# Altium project disp7segTester.PrjPcb
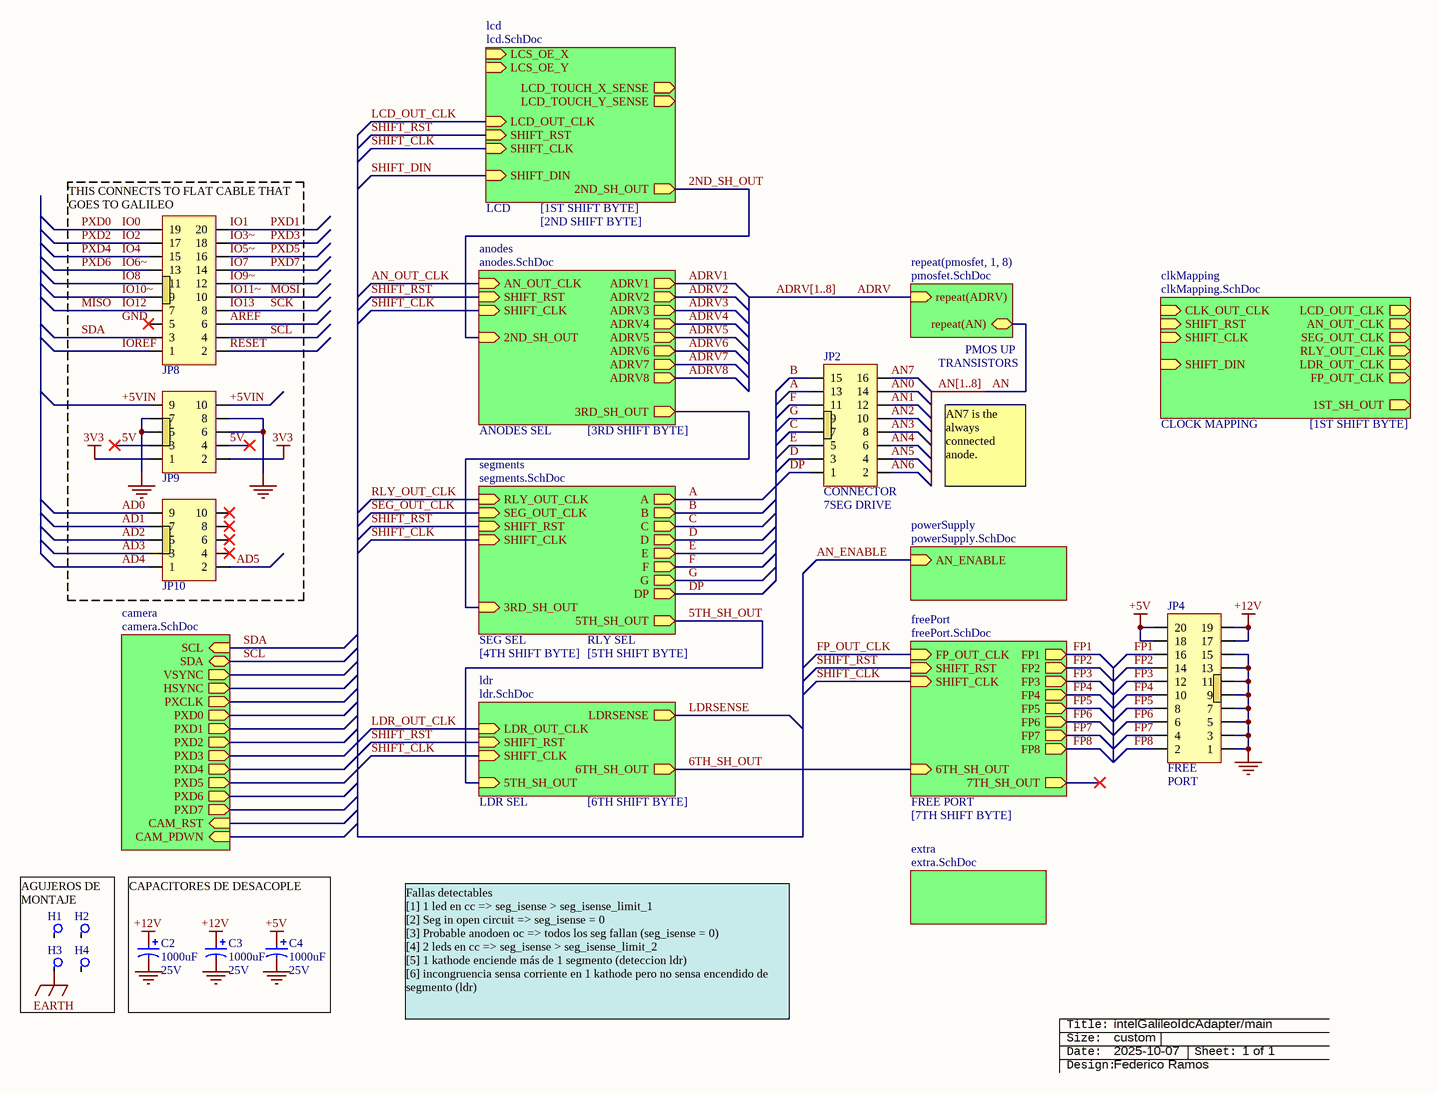
[diagram p0: disp7segTester.SchDoc]
14 sheets, 236 parts. Net scope: hierarchical (ports join the sheet entries above them; power ports are global).
Board file: disp7segTester.PcbDoc
Sheets:
  disp7segTester.SchDoc
    ldr = ldr.SchDoc
    segments = segments.SchDoc
      relayNetwork = relayNetwork.SchDoc
    anodes = anodes.SchDoc
    pmosfet1 = pmosfet.SchDoc
    pmosfet2 = pmosfet.SchDoc
    pmosfet3 = pmosfet.SchDoc
    pmosfet4 = pmosfet.SchDoc
    pmosfet5 = pmosfet.SchDoc
    pmosfet6 = pmosfet.SchDoc
    pmosfet7 = pmosfet.SchDoc
    pmosfet8 = pmosfet.SchDoc
    freePort = freePort.SchDoc
    powerSupply = powerSupply.SchDoc
    extra = extra.SchDoc
    camera = camera.SchDoc
      levelTranslate1 = levelTranslate.SchDoc
      levelTranslate2 = levelTranslate.SchDoc
      levelTranslate3 = levelTranslate.SchDoc
      levelTranslate4 = levelTranslate.SchDoc
      levelTranslate5 = levelTranslate.SchDoc
    lcd = lcd.SchDoc
    clkMapping = clkMapping.SchDoc
  signalTable.SchDoc

## Sheet disp7segTester.SchDoc: DE:TMP:11:UC:EXPANDIDO
size 386 x 254 mm; Date: 21-07-2022; SheetNumber: 1; SheetTotal: 1; WebFGR: www.abebashop.com; VersionFGR: 20220721; PageSetup: Record=PageOptions|CenterHorizontal=True|CenterVertical=True|PrintScale=0.74|XCorrection=1.00|YCorrection=1.00|PrintKind=0|BorderSize=5000000|LeftOffset=0|BottomOffset=0|Orientation=2|PaperLength=1000|PaperWidth=1000|Scale=100|PaperSource=7|PrintQuality=-4|MediaType=1|DitherType=10|PaperKind=Letter|PrintScaleMode=1

### Parts
(Parts that share a designator on the sheet are numbered #1, #2 ... from top to bottom, then left to right.)
C2  value 1000uF  Voltaje: 25V  [C_EL_6-3X11]  (hidden comment: Cap Pol)
C3  value 1000uF  Voltaje: 25V  [C_EL_6-3X11]  (hidden comment: Cap Pol)
C4  value 1000uF  Voltaje: 25V  [C_EL_6-3X11]  (hidden comment: Cap Pol)
H1  Agujero de montaje  [agujero]  (value not drawn)
H2  Agujero de montaje  [agujero]  (value not drawn)
H3  Agujero de montaje  [agujero]  (value not drawn)
H4  Agujero de montaje  [agujero]  (value not drawn)
JP2  con: CONNECTOR  [idc8x2_90]  (hidden comment: IDC 8x2 90deg)
JP4  IDC 10x2  [idc10x2]  (value not drawn)
JP8  IDC 10x2 90deg  [idc10x2_90]  (value not drawn)
JP9  IDC 5x2  [IDC5x2_90]  (value not drawn)
JP10  IDC 5x2  [IDC5x2_90]  (value not drawn)
ROT?#1  Rotulo_empty  (value not drawn)  (graphical)

### Sub-sheets
anodes = anodes.SchDoc: 3RD_SH_OUT (out), AN_OUT_CLK (in), SHIFT_RST (in), SHIFT_CLK (in), 2ND_SH_OUT (in), ADRV1 (out), ADRV2 (out), ADRV3 (out), ADRV4 (out), ADRV5 (out), ADRV6 (out), ADRV7 (out), ADRV8 (out)  | : [3RD SHIFT BYTE]; : ANODES SEL
camera = camera.SchDoc: SCL (in), SDA (bidir), VSYNC (out), HSYNC (out), PXD0 (out), PXD1 (out), PXD2 (out), PXD3 (out), PXD4 (out), PXD5 (out), PXD6 (out), PXD7 (out), CAM_RST (in), CAM_PDWN (in), PXCLK (out)
clkMapping = clkMapping.SchDoc: 1ST_SH_OUT (out), CLK_OUT_CLK (in), SHIFT_RST (in), SHIFT_CLK (in), SHIFT_DIN (in), LCD_OUT_CLK (out), AN_OUT_CLK (out), SEG_OUT_CLK (out), RLY_OUT_CLK (out), LDR_OUT_CLK (out), FP_OUT_CLK (out)  | : [1ST SHIFT BYTE]; : CLOCK MAPPING
extra = extra.SchDoc: no entries
freePort = freePort.SchDoc: 7TH_SH_OUT (out), FP_OUT_CLK (in), SHIFT_RST (in), SHIFT_CLK (in), 6TH_SH_OUT (in), FP1 (out), FP2 (out), FP3 (out), FP4 (out), FP5 (out), FP6 (out), FP7 (out), FP8 (out)  | : [7TH SHIFT BYTE]; : FREE PORT
lcd = lcd.SchDoc: LCD_OUT_CLK (in), SHIFT_RST (in), SHIFT_CLK (in), SHIFT_DIN (in), 2ND_SH_OUT (out), LCS_OE_Y (in), LCS_OE_X (in), LCD_TOUCH_X_SENSE (out), LCD_TOUCH_Y_SENSE (out)  | : LCD; : [1ST SHIFT BYTE]; : [2ND SHIFT BYTE]
ldr = ldr.SchDoc: LDRSENSE (out), LDR_OUT_CLK (in), SHIFT_RST (in), SHIFT_CLK (in), 5TH_SH_OUT (in), 6TH_SH_OUT (out)  | : [6TH SHIFT BYTE]; : LDR SEL
powerSupply = powerSupply.SchDoc: AN_ENABLE (in)
repeat(pmosfet, 1, 8) = pmosfet.SchDoc: repeat(AN), repeat(ADRV) (in)  | : TRANSISTORS; : PMOS UP
segments = segments.SchDoc: 5TH_SH_OUT (out), RLY_OUT_CLK (in), SEG_OUT_CLK (in), SHIFT_RST (in), SHIFT_CLK (in), 3RD_SH_OUT (in), A (out), B (out), C (out), D (out), E (out), F (out), G (out), DP (out)  | : [5TH SHIFT BYTE]; : SEG SEL; : RLY SEL; : [4TH SHIFT BYTE]

### Nets
3V3: JP9.1 JP9.2
+5V: C4.1 JP4.18 JP4.20
+12V: C2.1 C3.1 JP4.17 JP4.19
EARTH: H3.1
GND: C2.2 C3.2 C4.2 JP4.1 JP4.3 JP4.5 JP4.7 JP4.9 JP4.11 JP4.13 JP4.15 JP9.5 JP9.6 JP9.7 JP9.8
2ND_SH_OUT: sheet anodes/2ND_SH_OUT, sheet lcd/2ND_SH_OUT
3RD_SH_OUT: sheet segments/3RD_SH_OUT, sheet anodes/3RD_SH_OUT
5TH_SH_OUT: sheet ldr/5TH_SH_OUT, sheet segments/5TH_SH_OUT
5V: JP9.3 JP9.4
6TH_SH_OUT: sheet ldr/6TH_SH_OUT, sheet freePort/6TH_SH_OUT
+5VIN: JP9.9 JP9.10
A: JP2.13 ; sheet segments/A
AD0: JP10.9
AD1: JP10.7
AD2: JP10.5
AD3: JP10.3
AD4: JP10.1
AD5: JP10.2
AN0: JP2.14
AN1: JP2.12
AN2: JP2.10
AN3: JP2.8
AN4: JP2.6
AN5: JP2.4
AN6: JP2.2
AN7: JP2.16
AREF: JP8.6
B: JP2.15 ; sheet segments/B
C: JP2.7 ; sheet segments/C
D: JP2.3 ; sheet segments/D
DP: JP2.1 ; sheet segments/DP
E: JP2.5 ; sheet segments/E
F: JP2.11 ; sheet segments/F
FP1: JP4.16 ; sheet freePort/FP1
FP2: JP4.14 ; sheet freePort/FP2
FP3: JP4.12 ; sheet freePort/FP3
FP4: JP4.10 ; sheet freePort/FP4
FP5: JP4.8 ; sheet freePort/FP5
FP6: JP4.6 ; sheet freePort/FP6
FP7: JP4.4 ; sheet freePort/FP7
FP8: JP4.2 ; sheet freePort/FP8
G: JP2.9 ; sheet segments/G
IO0: JP8.19  [also labelled PXD0]
IO1: JP8.20  [also labelled PXD1]
IO2: JP8.17  [also labelled PXD2]
IO3~: JP8.18  [also labelled PXD3]
IO4: JP8.15  [also labelled PXD4]
IO5~: JP8.16  [also labelled PXD5]
IO6~: JP8.13  [also labelled PXD6]
IO7: JP8.14  [also labelled PXD7]
IO8: JP8.11
IO9~: JP8.12
IO10~: JP8.9
IO11~: JP8.10  [also labelled MOSI]
IO12: JP8.7  [also labelled MISO]
IO13: JP8.8  [also labelled SCK]
IOREF: JP8.1
RESET: JP8.2
SCL: JP8.4 ; sheet camera/SDA
SDA: JP8.3 ; sheet camera/SCL  [project net SCL]
SHIFT_CLK: sheet ldr/SHIFT_CLK, sheet segments/SHIFT_CLK, sheet anodes/SHIFT_CLK, sheet freePort/SHIFT_CLK, sheet lcd/SHIFT_CLK
SHIFT_RST: sheet ldr/SHIFT_RST, sheet segments/SHIFT_RST, sheet anodes/SHIFT_RST, sheet freePort/SHIFT_RST, sheet lcd/SHIFT_RST

Not connected (* = marked no-connect by the designer): H1 1; H2 1; H4 1; JP8 5*; JP10 4* 6* 8* 10*

### Buses and harness runs
bus ADRV[1..8]
bus AN[1..8]

### Notes on the sheet
- (near JP8) THIS CONNECTS TO FLAT CABLE THAT GOES TO GALILEO
- AN7 is the always connected anode.
- AGUJEROS DE MONTAJE
- CAPACITORES DE DESACOPLE
- Fallas detectables
  [1] 1 led en cc => seg_isense > seg_isense_limit_1
  [2] Seg in open circuit => seg_isense = 0
  [3] Probable anodoen oc => todos los seg fallan (seg_isense = 0)
  [4] 2 leds en cc => seg_isense > seg_isense_limit_2
  [5] 1 kathode enciende más de 1 segmento (deteccion ldr)
  [6] incongruencia sensa corriente en 1 kathode pero no sensa encendido de segmento (ldr)
- intelGalileoIdcAdapter/main
- custom
- 2025-10-07
- (near ROT?#1) 1 of 1
- Federico Ramos
- Labels drawn without touching a wire or pin: GND
- (in symbol IDC 5x2) AUX; OTRAS; SEÑALES
- (in symbol IDC 8x2 90deg) 7SEG DRIVE
- (in symbol IDC 10x2) FREE; PORT
- (in symbol Rotulo_empty) Title:; Size:; Date:; Sheet:; Design:

### Library data of the parts
C2-C4 = Cap Pol: Capacitor Electrolítico
JP2 = IDC 8x2 90deg: outout: OUTPUT; drv: DRIVE
ROT?#1 = Rotulo_empty: Rotulo [consolas]

## Sheet ldr.SchDoc: DE:TMP:11:UC:EXPANDIDO
size 203 x 139 mm; Date: 21-07-2022; SheetNumber: 1; SheetTotal: 1; WebFGR: www.abebashop.com; VersionFGR: 20220721; PageSetup: Record=PageOptions|CenterHorizontal=True|CenterVertical=True|PrintScale=0.94|XCorrection=1.00|YCorrection=1.00|PrintKind=0|BorderSize=5000000|LeftOffset=0|BottomOffset=0|Orientation=2|PaperLength=1000|PaperWidth=1000|Scale=100|PaperSource=7|PrintQuality=-4|MediaType=1|DitherType=10|PaperKind=Letter|PrintScaleMode=1
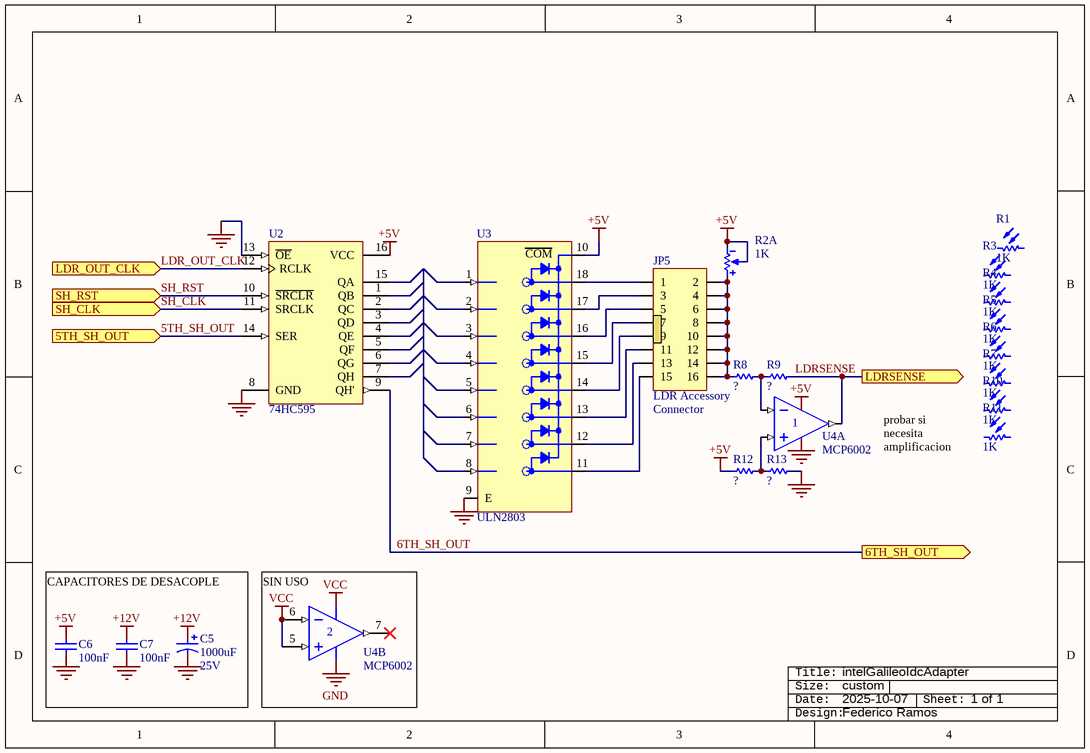
[diagram p1: ldr.SchDoc]

### Parts
(Parts that share a designator on the sheet are numbered #1, #2 ... from top to bottom, then left to right.)
C5  value 1000uF  Voltaje: 25V  [C_EL_6-3X11]  (hidden comment: Cap Pol)
C6  value 100nF  [c1206]  (hidden comment: Cap)
C7  value 100nF  [c1206]  (hidden comment: Cap)
JP5  IDC 8x2  [idc8x2]  (value not drawn)
R1  value 1K  [0805]  (hidden comment: LDR)
R2  value 1K  [conpol4x1]  (hidden comment: RVar)  (part A of 2)
R3  value 1K  [0805]  (hidden comment: LDR)
R4  value 1K  [0805]  (hidden comment: LDR)
R5  value 1K  [0805]  (hidden comment: LDR)
R6  value 1K  [0805]  (hidden comment: LDR)
R7  value 1K  [0805]  (hidden comment: LDR)
R8  Res  [R1206]  (value not drawn)
R9  Res  [R1206]  (value not drawn)
R10  value 1K  [0805]  (hidden comment: LDR)
R11  value 1K  [0805]  (hidden comment: LDR)
R12  Res  [R1206]  (value not drawn)
R13  Res  [R1206]  (value not drawn)
ROT?#2  Rotulo_empty  (value not drawn)  (graphical)
U2  74HC595  [DIP16]
U3  ULN2803  [DIP18Z]
U4  MCP6002  [dip8z]  (parts A,B of 2)

### Ports
5TH_SH_OUT (in), 6TH_SH_OUT (out), LDR_OUT_CLK (in), LDRSENSE (out), SH_CLK (in), SH_RST (in)

### Nets
+5V: C6.2 R2.2 R2.3 R12.2 U2.16(VCC) U3.10(~{COM}) U4.8(V+)
+12V: C5.1 C7.2
GND: C5.2 C6.1 C7.1 R13.1 U2.8(GND) U2.13(~{OE}) U3.9(E) U4.4(V-)
VCC: U4.5(IN+) U4.6(IN-) U4.8(V+)
5TH_SH_OUT: U2.14(SER) ; port 5TH_SH_OUT
6TH_SH_OUT: U2.9(QH') ; port 6TH_SH_OUT
LDR_OUT_CLK: U2.12(RCLK) ; port LDR_OUT_CLK
LDRSENSE: R9.1 U4.1(OUT) ; port LDRSENSE
SH_CLK: U2.11(SRCLK) ; port SH_CLK
SH_RST: U2.10(~{SRCLR}) ; port SH_RST
NetJP5_1: JP5.1 U3.18(~{C}1)
NetJP5_2: JP5.2 JP5.4 JP5.6 JP5.8 JP5.10 JP5.12 JP5.14 JP5.16 R2.1 R8.2
NetJP5_3: JP5.3 U3.17(~{C}2)
NetJP5_5: JP5.5 U3.16(~{C}3)
NetJP5_7: JP5.7 U3.15(~{C}4)
NetJP5_9: JP5.9 U3.14(~{C}5)
NetJP5_11: JP5.11 U3.13(~{C}6)
NetJP5_13: JP5.13 U3.12(~{C}7)
NetJP5_15: JP5.15 U3.11(~{C}8)
NetR8_1: R8.1 R9.2 U4.2(IN-)
NetR12_1: R12.1 R13.2 U4.3(IN+)

Not connected (* = marked no-connect by the designer): R1 1 2; R3 1 2; R4 1 2; R5 1 2; R6 1 2; R7 1 2; R10 1 2; R11 1 2; U2 1(QB) 2(QC) 3(QD) 4(QE) 5(QF) 6(QG) 7(QH) 15(QA); U3 1(B1) 2(B2) 3(B3) 4(B4) 5(B5) 6(B6) 7(B7) 8(B8); U4 7(OUT)*

### Notes on the sheet
- probar si necesita amplificacion
- CAPACITORES DE DESACOPLE
- (near U4) SIN USO
- intelGalileoIdcAdapter
- custom
- 2025-10-07
- (near ROT?#2) 1 of 1
- Federico Ramos
- (in symbol IDC 8x2) LDR Accessory; Connector
- (in symbol Rotulo_empty) Title:; Size:; Date:; Sheet:; Design:
- (in symbol ULN2803) COM

### Library data of the parts
C5 = Cap Pol: Capacitor Electrolítico
C6 C7 = Cap: Capacitor; Voltage: 50V
R1 R3-R7 R10 R11 = LDR: Resistor; Power: 0.25W
R2 = RVar: Resistencia Variable; Set Position: 0,5
R8 R9 R12 R13 = Res: Resistencia; Power: 0.25W
ROT?#2 = Rotulo_empty: Rotulo [consolas]
U2 = 74HC595: 8-Bit Shift Register with 3-State Output Registers
U3 = ULN2803: Darlington Transistor Array
U4 = MCP6002: 1 MHz Bandwidth Low Power Op Amp

## Sheet segments.SchDoc: DE:TMP:11:UC:EXPANDIDO
size 248 x 127 mm; Date: 21-07-2022; SheetNumber: 1; SheetTotal: 1; WebFGR: www.abebashop.com; VersionFGR: 20220721; PageSetup: Record=PageOptions|CenterHorizontal=True|CenterVertical=True|PrintScale=0.94|XCorrection=1.00|YCorrection=1.00|PrintKind=0|BorderSize=5000000|LeftOffset=0|BottomOffset=0|Orientation=2|PaperLength=1000|PaperWidth=1000|Scale=100|PaperSource=7|PrintQuality=-4|MediaType=1|DitherType=10|PaperKind=Letter|PrintScaleMode=1
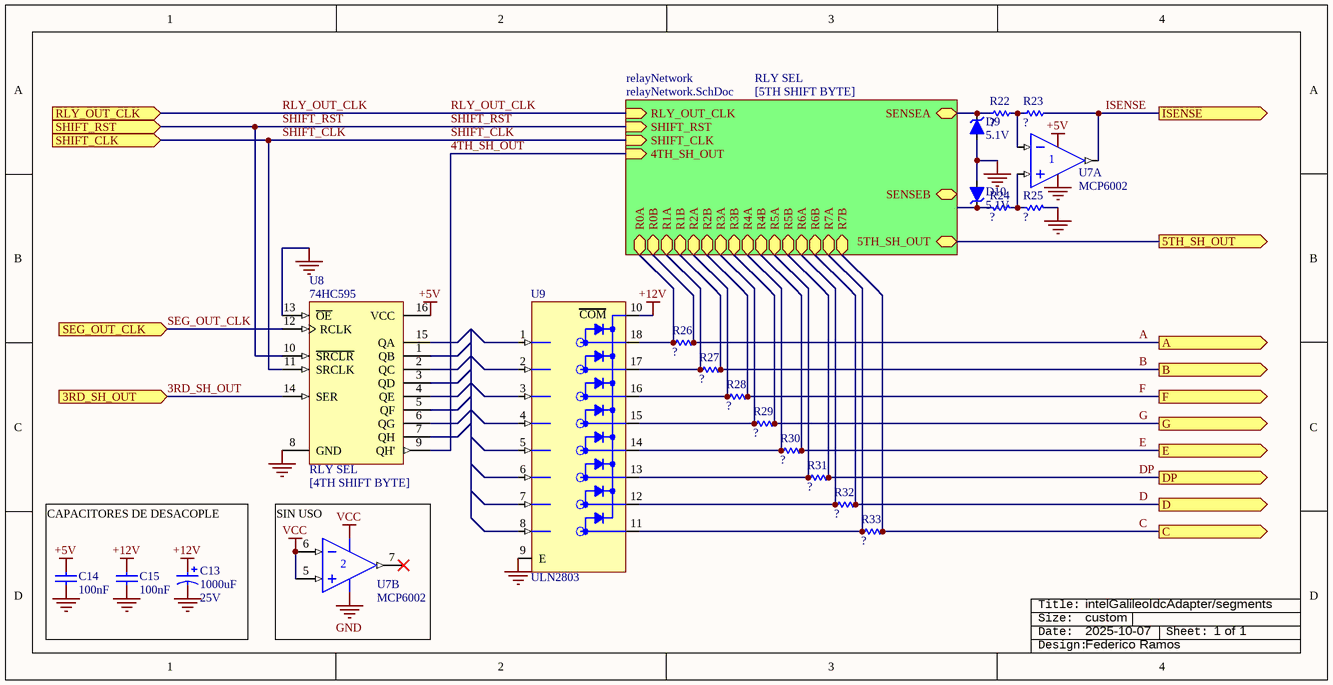
[diagram p2: segments.SchDoc]

### Parts
(Parts that share a designator on the sheet are numbered #1, #2 ... from top to bottom, then left to right.)
C13  value 1000uF  Voltaje: 25V  [C_EL_6-3X11]  (hidden comment: Cap Pol)
C14  value 100nF  [c1206]  (hidden comment: Cap)
C15  value 100nF  [c1206]  (hidden comment: Cap)
D9  VOLTAJE: 5.1V  [D_SOD27]  (hidden comment: Zener)
D10  VOLTAJE: 5.1V  [D_SOD27]  (hidden comment: Zener)
R22  Res  [R1206]  (value not drawn)
R23  Res  [R1206]  (value not drawn)
R24  Res  [R1206]  (value not drawn)
R25  Res  [R1206]  (value not drawn)
R26  Res  [R1206]  (value not drawn)
R27  Res  [R1206]  (value not drawn)
R28  Res  [R1206]  (value not drawn)
R29  Res  [R1206]  (value not drawn)
R30  Res  [R1206]  (value not drawn)
R31  Res  [R1206]  (value not drawn)
R32  Res  [R1206]  (value not drawn)
R33  Res  [R1206]  (value not drawn)
ROT?#3  Rotulo_empty  (value not drawn)  (graphical)
U7  MCP6002  [dip8z]  (parts A,B of 2)
U8  74HC595  [DIP16]
U9  ULN2803  [DIP18Z]

### Sub-sheets
relayNetwork = relayNetwork.SchDoc: R0A, R0B, R1A, R1B, R2A, R2B, R3A, R3B, R4A, R4B, R5A, R5B, R6A, R6B, R7A, R7B, SENSEB, SENSEA, RLY_OUT_CLK (in), SHIFT_RST (in), SHIFT_CLK (in), 4TH_SH_OUT (in), 5TH_SH_OUT  | : [5TH SHIFT BYTE]; : RLY SEL

### Ports
3RD_SH_OUT (in), 5TH_SH_OUT (out), A (out), B (out), C (out), D (out), DP (out), E (out), F (out), G (out), ISENSE (out), RLY_OUT_CLK (in), SEG_OUT_CLK (in), SHIFT_CLK (in), SHIFT_RST (in)

### Nets
+5V: C14.2 U7.8(V+) U8.16(VCC)
+12V: C13.1 C15.2 U9.10(~{COM})
GND: C13.2 C14.1 C15.1 D9.1(A) D10.1(A) R25.1 U7.4(V-) U8.8(GND) U8.13(~{OE}) U9.9(E)
VCC: U7.5(IN+) U7.6(IN-) U7.8(V+)
3RD_SH_OUT: U8.14(SER) ; port 3RD_SH_OUT
4TH_SH_OUT: U8.9(QH') ; sheet relayNetwork/4TH_SH_OUT
5TH_SH_OUT: port 5TH_SH_OUT, sheet relayNetwork/5TH_SH_OUT
A: R26.1 ; port A, sheet relayNetwork/R0B
B: R27.1 ; port B, sheet relayNetwork/R1B
C: R33.1 ; port C, sheet relayNetwork/R7B
D: R32.1 ; port D, sheet relayNetwork/R6B
DP: R31.1 ; port DP, sheet relayNetwork/R5B
E: R30.1 ; port E, sheet relayNetwork/R4B
F: R28.1 ; port F, sheet relayNetwork/R2B
G: R29.1 ; port G, sheet relayNetwork/R3B
ISENSE: R23.1 U7.1(OUT) ; port ISENSE
RLY_OUT_CLK: port RLY_OUT_CLK, sheet relayNetwork/RLY_OUT_CLK
SEG_OUT_CLK: U8.12(RCLK) ; port SEG_OUT_CLK
SHIFT_CLK: U8.11(SRCLK) ; port SHIFT_CLK, sheet relayNetwork/SHIFT_CLK
SHIFT_RST: U8.10(~{SRCLR}) ; port SHIFT_RST, sheet relayNetwork/SHIFT_RST
NetD9_2: D9.2(K) R22.2 ; sheet relayNetwork/SENSEA
NetD10_2: D10.2(K) R24.2
NetK1_8: R26.2 U9.18(~{C}1) ; sheet relayNetwork/R0A
NetK2_3: R27.2 U9.17(~{C}2) ; sheet relayNetwork/R1A
NetK3_8: R29.2 U9.15(~{C}4) ; sheet relayNetwork/R3A
NetK4_3: R30.2 U9.14(~{C}5) ; sheet relayNetwork/R4A
NetK5_8: R32.2 U9.12(~{C}7) ; sheet relayNetwork/R6A
NetR22_1: R22.1 R23.2 U7.2(IN-)
NetR24_1: R24.1 R25.2 U7.3(IN+)
NetR28_2: R28.2 U9.16(~{C}3) ; sheet relayNetwork/R2A
NetR31_2: R31.2 U9.13(~{C}6) ; sheet relayNetwork/R5A
NetR33_2: R33.2 U9.11(~{C}8) ; sheet relayNetwork/R7A

Not connected (* = marked no-connect by the designer): U7 7(OUT)*; U8 1(QB) 2(QC) 3(QD) 4(QE) 5(QF) 6(QG) 7(QH) 15(QA); U9 1(B1) 2(B2) 3(B3) 4(B4) 5(B5) 6(B6) 7(B7) 8(B8)

### Notes on the sheet
- CAPACITORES DE DESACOPLE
- (near U7) SIN USO
- (near ROT?#3) intelGalileoIdcAdapter/segments
- custom
- 2025-10-07
- (near ROT?#3) 1 of 1
- Federico Ramos
- (in symbol 74HC595) RLY SEL; [4TH SHIFT BYTE]
- (in symbol Rotulo_empty) Title:; Size:; Date:; Sheet:; Design:
- (in symbol ULN2803) COM

### Library data of the parts
C13 = Cap Pol: Capacitor Electrolítico
C14 C15 = Cap: Capacitor; Voltage: 50V
D9 D10 = Zener: Zener Diode
R22-R33 = Res: Resistencia; Power: 0.25W
ROT?#3 = Rotulo_empty: Rotulo [consolas]
U7 = MCP6002: 1 MHz Bandwidth Low Power Op Amp
U8 = 74HC595: as U2 on sheet ldr
U9 = ULN2803: Darlington Transistor Array

## Sheet relayNetwork.SchDoc: DE:TMP:11:UC:EXPANDIDO
size 172 x 132 mm; Date: 21-07-2022; SheetNumber: 1; SheetTotal: 1; WebFGR: www.abebashop.com; VersionFGR: 20220721; PageSetup: Record=PageOptions|CenterHorizontal=True|CenterVertical=True|PrintScale=0.94|XCorrection=1.00|YCorrection=1.00|PrintKind=0|BorderSize=5000000|LeftOffset=0|BottomOffset=0|Orientation=2|PaperLength=1000|PaperWidth=1000|Scale=100|PaperSource=7|PrintQuality=-4|MediaType=1|DitherType=10|PaperKind=Letter|PrintScaleMode=1
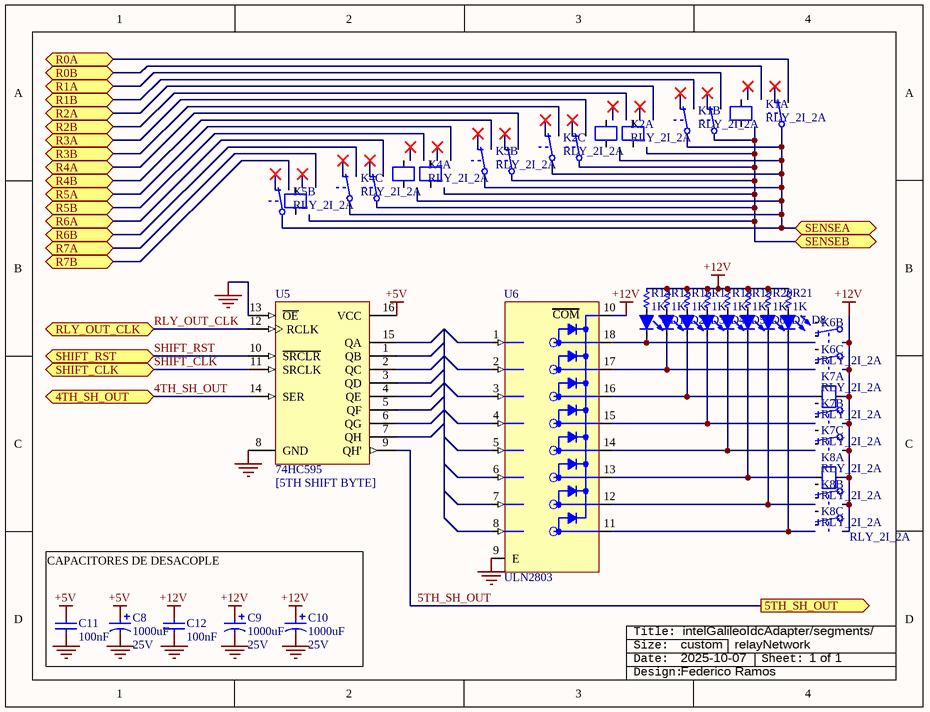
[diagram p3: relayNetwork.SchDoc]

### Parts
(Parts that share a designator on the sheet are numbered #1, #2 ... from top to bottom, then left to right.)
C8  value 1000uF  Voltaje: 25V  [C_EL_6-3X11]  (hidden comment: Cap Pol)
C9  value 1000uF  Voltaje: 25V  [C_EL_6-3X11]  (hidden comment: Cap Pol)
C10  value 1000uF  Voltaje: 25V  [C_EL_6-3X11]  (hidden comment: Cap Pol)
C11  value 100nF  [c1206]  (hidden comment: Cap)
C12  value 100nF  [c1206]  (hidden comment: Cap)
D1  Led 5mm Rojo Difuso  [LED5mm ROJO]  (value not drawn)
D2  Led 5mm Rojo Difuso  [LED5mm ROJO]  (value not drawn)
D3  Led 5mm Rojo Difuso  [LED5mm ROJO]  (value not drawn)
D4  Led 5mm Rojo Difuso  [LED5mm ROJO]  (value not drawn)
D5  Led 5mm Rojo Difuso  [LED5mm ROJO]  (value not drawn)
D6  Led 5mm Rojo Difuso  [LED5mm ROJO]  (value not drawn)
D7  Led 5mm Rojo Difuso  [LED5mm ROJO]  (value not drawn)
D8  Led 5mm Rojo Difuso  [LED5mm ROJO]  (value not drawn)
K1  RLY_2I_2A  [relay4]  (parts A,B,C of 3)
K2  RLY_2I_2A  [relay4]  (parts A,B,C of 3)
K3  RLY_2I_2A  [relay4]  (value not drawn)  (parts A,B,C of 3)
K4  RLY_2I_2A  [relay4]  (parts A,B,C of 3)
K5  RLY_2I_2A  [relay4]  (value not drawn)  (parts A,B,C of 3)
K6  RLY_2I_2A  [relay4]  (value not drawn)  (parts A,B,C of 3)
K7  RLY_2I_2A  [relay4]  (parts A,B,C of 3)
K8  RLY_2I_2A  [relay4]  (parts A,B,C of 3)
R14#1  value 1K  [R1206]  (hidden comment: Res)
R15  value 1K  [R1206]  (hidden comment: Res)
R16  value 1K  [R1206]  (hidden comment: Res)
R17  value 1K  [R1206]  (hidden comment: Res)
R18  value 1K  [R1206]  (hidden comment: Res)
R19  value 1K  [R1206]  (hidden comment: Res)
R20  value 1K  [R1206]  (hidden comment: Res)
R21  value 1K  [R1206]  (hidden comment: Res)
ROT?#4  Rotulo_empty_longTitle  (value not drawn)  (graphical)
U5  74HC595  [DIP16]
U6  ULN2803  [DIP18Z]

### Ports
4TH_SH_OUT, 5TH_SH_OUT (out), R0A, R0B, R1A, R1B, R2A, R2B, R3A, R3B, R4A, R4B, R5A, R5B, R6A, R6B, R7A, R7B, RLY_OUT_CLK, SENSEA, SENSEB, SHIFT_CLK, SHIFT_RST

### Nets
+5V: C8.1 C11.2 U5.16(VCC)
+12V: C9.1 C10.1 C12.2 K7.5 K8.5 R14#1.2 R15.2 R16.2 R17.2 R18.2 R19.2 R20.2 R21.2 U6.10(~{COM})
GND: C8.2 C9.2 C10.2 C11.1 C12.1 U5.8(GND) U5.13(~{OE}) U6.9(E)
4TH_SH_OUT: U5.14(SER) ; port 4TH_SH_OUT
5TH_SH_OUT: U5.9(QH') ; port 5TH_SH_OUT
B: K1.3 ; port R1B
C: K5.3 ; port R7B
D: K4.8 ; port R6B
E: K3.3 ; port R4B
G: K2.8 ; port R3B
RLY_OUT_CLK: U5.12(RCLK) ; port RLY_OUT_CLK
SHIFT_CLK: U5.11(SRCLK) ; port SHIFT_CLK
SHIFT_RST: U5.10(~{SRCLR}) ; port SHIFT_RST
NetD1_1: D1.1(A) R14#1.1
NetD1_2: D1.2(K) U6.18(~{C}1)
NetD2_1: D2.1(A) R15.1
NetD2_2: D2.2(K) U6.17(~{C}2)
NetD3_1: D3.1(A) R16.1
NetD3_2: D3.2(K) K7.4 U6.16(~{C}3)
NetD4_1: D4.1(A) R17.1
NetD4_2: D4.2(K) U6.15(~{C}4)
NetD5_1: D5.1(A) R18.1
NetD5_2: D5.2(K) U6.14(~{C}5)
NetD6_1: D6.1(A) R19.1
NetD6_2: D6.2(K) K8.4 U6.13(~{C}6)
NetD7_1: D7.1(A) R20.1
NetD7_2: D7.2(K) U6.12(~{C}7)
NetD8_1: D8.1(A) R21.1
NetD8_2: D8.2(K) U6.11(~{C}8)
NetD9_2: K1.1 K1.6 K2.6 K3.1 K4.6 K5.1 ; port SENSEA
NetK1_8: K1.8 ; port R0A
NetK2_1: K2.1 K3.6 K4.1 K5.6 ; port SENSEB
NetK2_3: K2.3 ; port R1A
NetK3_8: K3.8 ; port R3A
NetK4_3: K4.3 ; port R4A
NetK5_8: K5.8 ; port R6A

Not connected (* = marked no-connect by the designer): K1 2* 4 5 7*; K2 2* 4 5 7*; K3 2* 4 5 7*; K4 2* 4 5 7*; K5 2* 4 5 7*; K6 1 2 3 4 5 6 7 8; K7 1 2 3 6 7 8; K8 1 2 3 6 7 8; U5 1(QB) 2(QC) 3(QD) 4(QE) 5(QF) 6(QG) 7(QH) 15(QA); U6 1(B1) 2(B2) 3(B3) 4(B4) 5(B5) 6(B6) 7(B7) 8(B8)

### Notes on the sheet
- CAPACITORES DE DESACOPLE
- custom
- 2025-10-07
- (near ROT?#4) intelGalileoIdcAdapter/segments/
- relayNetwork
- (near ROT?#4) 1 of 1
- Federico Ramos
- (in symbol 74HC595) [5TH SHIFT BYTE]
- (in symbol Rotulo_empty_longTitle) Title:; Size:; Date:; Sheet:; Design:
- (in symbol ULN2803) COM

### Library data of the parts
C8-C10 = Cap Pol: Capacitor Electrolítico
C11 C12 = Cap: Capacitor; Voltage: 50V
D1-D8 = Led 5mm Rojo Difuso: Codigo Ebay: NA; Dolares Ebay: 0.06
R14#1 R15-R21 = Res: Resistencia; Power: 0.25W
ROT?#4 = Rotulo_empty_longTitle: Rotulo [consolas]
U5 = 74HC595: as U2 on sheet ldr
U6 = ULN2803: Darlington Transistor Array

## Sheet anodes.SchDoc: DE:TMP:11:UC:EXPANDIDO
size 127 x 76 mm; Date: 21-07-2022; SheetNumber: 1; SheetTotal: 1; WebFGR: www.abebashop.com; VersionFGR: 20220721; PageSetup: Record=PageOptions|CenterHorizontal=True|CenterVertical=True|PrintScale=0.94|XCorrection=1.00|YCorrection=1.00|PrintKind=0|BorderSize=5000000|LeftOffset=0|BottomOffset=0|Orientation=2|PaperLength=1000|PaperWidth=1000|Scale=100|PaperSource=7|PrintQuality=-4|MediaType=1|DitherType=10|PaperKind=Letter|PrintScaleMode=1
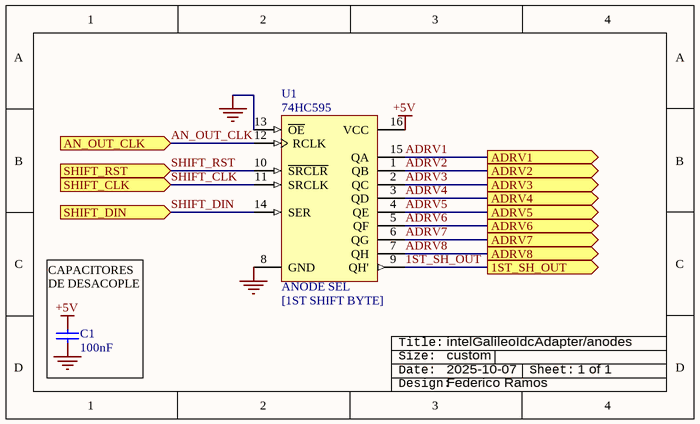
[diagram p4: anodes.SchDoc]

### Parts
(Parts that share a designator on the sheet are numbered #1, #2 ... from top to bottom, then left to right.)
C1#1  value 100nF  [c1206]  (hidden comment: Cap)
ROT?#5  Rotulo_empty  (value not drawn)  (graphical)
U1#1  74HC595  [DIP16]

### Ports
1ST_SH_OUT (out), ADRV1 (out), ADRV2 (out), ADRV3 (out), ADRV4 (out), ADRV5 (out), ADRV6 (out), ADRV7 (out), ADRV8 (out), AN_OUT_CLK (in), SHIFT_CLK (in), SHIFT_DIN (in), SHIFT_RST (in)

### Nets
+5V: C1#1.2 U1#1.16(VCC)
GND: C1#1.1 U1#1.8(GND) U1#1.13(~{OE})
1ST_SH_OUT: U1#1.9(QH') ; port 1ST_SH_OUT
ADRV1: U1#1.15(QA) ; port ADRV1  [project net ADRV]
ADRV2: U1#1.1(QB) ; port ADRV2  [project net ADRV]
ADRV3: U1#1.2(QC) ; port ADRV3  [project net ADRV]
ADRV4: U1#1.3(QD) ; port ADRV4  [project net ADRV]
ADRV5: U1#1.4(QE) ; port ADRV5  [project net ADRV]
ADRV6: U1#1.5(QF) ; port ADRV6  [project net ADRV]
ADRV7: U1#1.6(QG) ; port ADRV7  [project net ADRV]
ADRV8: U1#1.7(QH) ; port ADRV8  [project net ADRV]
AN_OUT_CLK: U1#1.12(RCLK) ; port AN_OUT_CLK
SHIFT_CLK: U1#1.11(SRCLK) ; port SHIFT_CLK
SHIFT_DIN: U1#1.14(SER) ; port SHIFT_DIN
SHIFT_RST: U1#1.10(~{SRCLR}) ; port SHIFT_RST

### Notes on the sheet
- (near C1#1) CAPACITORES DE DESACOPLE
- intelGalileoIdcAdapter/anodes
- custom
- 2025-10-07
- (near ROT?#5) 1 of 1
- Federico Ramos
- (in symbol 74HC595) ANODE SEL; [1ST SHIFT BYTE]
- (in symbol Rotulo_empty) Title:; Size:; Date:; Sheet:; Design:

### Library data of the parts
C1#1 = Cap: Capacitor; Voltage: 50V
ROT?#5 = Rotulo_empty: Rotulo [consolas]
U1#1 = 74HC595: as U2 on sheet ldr

## Sheet pmosfet.SchDoc: DE:TMP:11:UC:EXPANDIDO
size 101 x 76 mm; Date: 21-07-2022; SheetNumber: 1; SheetTotal: 1; WebFGR: www.abebashop.com; VersionFGR: 20220721; PageSetup: Record=PageOptions|CenterHorizontal=True|CenterVertical=True|PrintScale=0.94|XCorrection=1.00|YCorrection=1.00|PrintKind=0|BorderSize=5000000|LeftOffset=0|BottomOffset=0|Orientation=2|PaperLength=1000|PaperWidth=1000|Scale=100|PaperSource=7|PrintQuality=-4|MediaType=1|DitherType=10|PaperKind=Letter|PrintScaleMode=1
Used 8 times, as channels pmosfet1, pmosfet2, pmosfet3, pmosfet4, pmosfet5, pmosfet6, pmosfet7, pmosfet8. Parts and nets are listed once, with the designators drawn on the sheet.
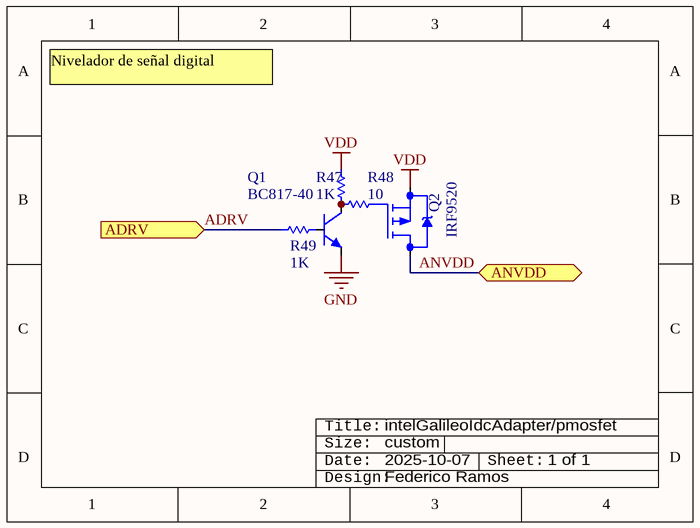
[diagram p5: pmosfet.SchDoc]

### Parts
Q1  BC817-40  [SOT23]
Q2  IRF9520  [TO220]
R47  Resistencia: 1K  [R1206]  (hidden comment: Resistencia 1206; 1Kohm)
R48  Resistencia: 10  [R1206]  (hidden comment: Resistencia 1206; 10ohm)
R49  Resistencia: 1K  [res300th]  (hidden comment: Resistencia 1206; 1Kohm)
ROT?  Rotulo_empty  (value not drawn)  (graphical)

### Ports
ADRV (in), ANVDD

### Nets
GND: Q1.2(E)
VDD: Q2.3(S) R47.2
ADRV: R49.1 ; port ADRV
ANVDD: Q2.2(D) ; port ANVDD
NetQ1_1: Q1.1(B) R49.2
NetQ1_3: Q1.3(C) R47.1 R48.1
NetQ2_1: Q2.1(G) R48.2

### Channels
pmosfet1: designators end in _pmosfet1; ports ADRV=ADRV ANVDD=ANVDD_pmosfet1
pmosfet2: designators end in _pmosfet2; ports ADRV=ADRV ANVDD=ANVDD_pmosfet2
pmosfet3: designators end in _pmosfet3; ports ADRV=ADRV ANVDD=ANVDD_pmosfet3
pmosfet4: designators end in _pmosfet4; ports ADRV=ADRV ANVDD=ANVDD_pmosfet4
pmosfet5: designators end in _pmosfet5; ports ADRV=ADRV ANVDD=ANVDD_pmosfet5
pmosfet6: designators end in _pmosfet6; ports ADRV=ADRV ANVDD=ANVDD_pmosfet6
pmosfet7: designators end in _pmosfet7; ports ADRV=ADRV ANVDD=ANVDD_pmosfet7
pmosfet8: designators end in _pmosfet8; ports ADRV=ADRV ANVDD=ANVDD_pmosfet8

### Notes on the sheet
- Nivelador de señal digital
- (near ROT?) intelGalileoIdcAdapter/pmosfet
- custom
- 2025-10-07
- (near ROT?) 1 of 1
- Federico Ramos
- (in symbol Rotulo_empty) Title:; Size:; Date:; Sheet:; Design:

### Library data of the parts
Q1 = BC817-40: Dolares Elemon: 0.03755; Codigo Elemon: TR1723021
Q2 = IRF9530: 100V  12A 0.3 ohm Power Field Effect Transistor
R47 R49 = Resistencia 1206; 1Kohm: Codigo Elemon: RS3886185; Dolares Elemon: 0.00720
R48 = Resistencia 1206; 10ohm: Codigo Elemon: RS3886070; Dolares Elemon: 0.00717
ROT? = Rotulo_empty: Rotulo [consolas]

## Sheet freePort.SchDoc: DE:TMP:11:UC:EXPANDIDO
size 142 x 83 mm; Date: 21-07-2022; SheetNumber: 1; SheetTotal: 1; WebFGR: www.abebashop.com; VersionFGR: 20220721; PageSetup: Record=PageOptions|CenterHorizontal=True|CenterVertical=True|PrintScale=0.94|XCorrection=1.00|YCorrection=1.00|PrintKind=0|BorderSize=5000000|LeftOffset=0|BottomOffset=0|Orientation=2|PaperLength=1000|PaperWidth=1000|Scale=100|PaperSource=7|PrintQuality=-4|MediaType=1|DitherType=10|PaperKind=Letter|PrintScaleMode=1
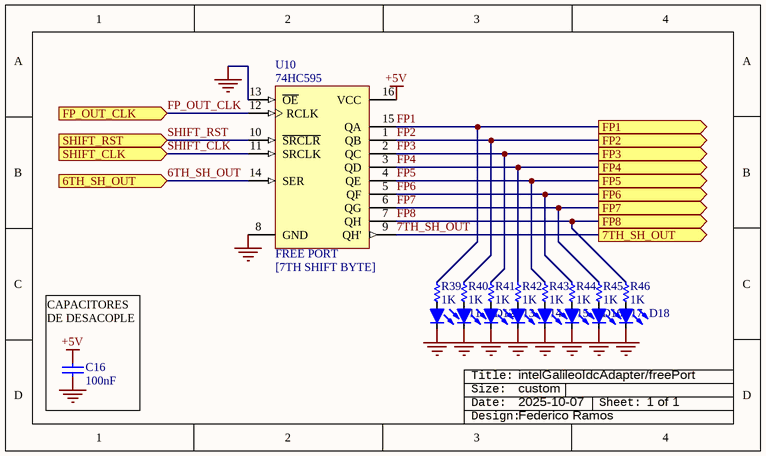
[diagram p6: freePort.SchDoc]

### Parts
(Parts that share a designator on the sheet are numbered #1, #2 ... from top to bottom, then left to right.)
C16  value 100nF  [c1206]  (hidden comment: Cap)
D11  LED  [3528]  (value not drawn)
D12  LED  [3528]  (value not drawn)
D13  LED  [3528]  (value not drawn)
D14  LED  [3528]  (value not drawn)
D15  LED  [3528]  (value not drawn)
D16  LED  [3528]  (value not drawn)
D17  LED  [3528]  (value not drawn)
D18  LED  [3528]  (value not drawn)
R39  value 1K  [R1206]  (hidden comment: Res)
R40  value 1K  [R1206]  (hidden comment: Res)
R41  value 1K  [R1206]  (hidden comment: Res)
R42  value 1K  [R1206]  (hidden comment: Res)
R43  value 1K  [R1206]  (hidden comment: Res)
R44  value 1K  [R1206]  (hidden comment: Res)
R45  value 1K  [R1206]  (hidden comment: Res)
R46  value 1K  [R1206]  (hidden comment: Res)
ROT?#6  Rotulo_empty  (value not drawn)  (graphical)
U10  74HC595  [DIP16]

### Ports
6TH_SH_OUT (in), 7TH_SH_OUT (out), FP1 (out), FP2 (out), FP3 (out), FP4 (out), FP5 (out), FP6 (out), FP7 (out), FP8 (out), FP_OUT_CLK (in), SHIFT_CLK (in), SHIFT_RST (in)

### Nets
+5V: C16.2 U10.16(VCC)
GND: C16.1 D11.2(K) D12.2(K) D13.2(K) D14.2(K) D15.2(K) D16.2(K) D17.2(K) D18.2(K) U10.8(GND) U10.13(~{OE})
6TH_SH_OUT: U10.14(SER) ; port 6TH_SH_OUT
7TH_SH_OUT: U10.9(QH') ; port 7TH_SH_OUT
FP1: R39.2 U10.15(QA) ; port FP1
FP2: R40.2 U10.1(QB) ; port FP2
FP3: R41.2 U10.2(QC) ; port FP3
FP4: R42.2 U10.3(QD) ; port FP4
FP5: R43.2 U10.4(QE) ; port FP5
FP6: R44.2 U10.5(QF) ; port FP6
FP7: R45.2 U10.6(QG) ; port FP7
FP8: R46.2 U10.7(QH) ; port FP8
FP_OUT_CLK: U10.12(RCLK) ; port FP_OUT_CLK
SHIFT_CLK: U10.11(SRCLK) ; port SHIFT_CLK
SHIFT_RST: U10.10(~{SRCLR}) ; port SHIFT_RST
NetD11_1: D11.1(A) R39.1
NetD12_1: D12.1(A) R40.1
NetD13_1: D13.1(A) R41.1
NetD14_1: D14.1(A) R42.1
NetD15_1: D15.1(A) R43.1
NetD16_1: D16.1(A) R44.1
NetD17_1: D17.1(A) R45.1
NetD18_1: D18.1(A) R46.1

### Notes on the sheet
- (near C16) CAPACITORES DE DESACOPLE
- intelGalileoIdcAdapter/freePort
- custom
- 2025-10-07
- 1 of 1
- Federico Ramos
- (in symbol 74HC595) FREE PORT; [7TH SHIFT BYTE]
- (in symbol Rotulo_empty) Title:; Size:; Date:; Sheet:; Design:

### Library data of the parts
C16 = Cap: Capacitor; Voltage: 50V
D11-D18 = LED: Color: Green
R39-R46 = Res: Resistencia; Power: 0.25W
ROT?#6 = Rotulo_empty: Rotulo [consolas]
U10 = 74HC595: as U2 on sheet ldr

## Sheet powerSupply.SchDoc: DE:TMP:11:UC:EXPANDIDO
size 233 x 233 mm; Date: 21-07-2022; SheetNumber: 1; SheetTotal: 1; WebFGR: www.abebashop.com; VersionFGR: 20220721; PageSetup: Record=PageOptions|CenterHorizontal=True|CenterVertical=True|PrintScale=0.94|XCorrection=1.00|YCorrection=1.00|PrintKind=0|BorderSize=5000000|LeftOffset=0|BottomOffset=0|Orientation=2|PaperLength=1000|PaperWidth=1000|Scale=100|PaperSource=7|PrintQuality=-4|MediaType=1|DitherType=10|PaperKind=Letter|PrintScaleMode=1
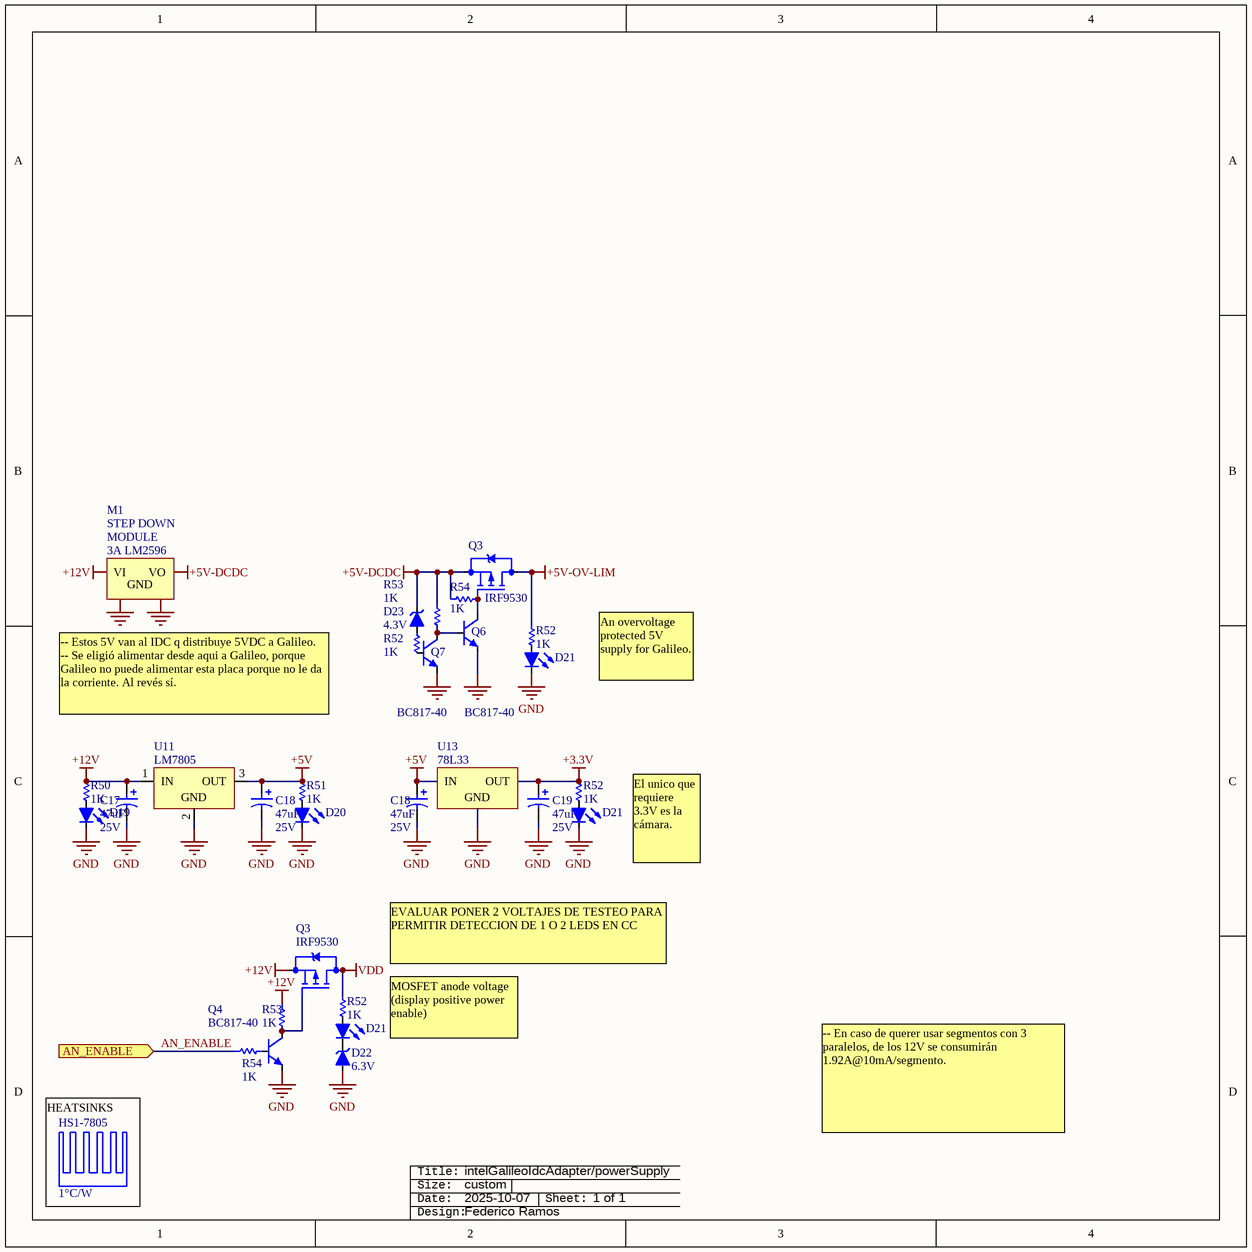
[diagram p7: powerSupply.SchDoc]

### Parts
(Parts that share a designator on the sheet are numbered #1, #2 ... from top to bottom, then left to right.)
C17  value 47uF  Voltaje: 25V  [C_EL_6-3X11]  (hidden comment: Cap Pol)
C18#1  value 47uF  Voltaje: 25V  [C_EL_6-3X11]  (hidden comment: Cap Pol)
C18#2  value 47uF  Voltaje: 25V  [C_EL_6-3X11]  (hidden comment: Cap Pol)
C19  value 47uF  Voltaje: 25V  [C_EL_6-3X11]  (hidden comment: Cap Pol)
D19  Led 5mm Rojo Difuso  [LED5mm ROJO]  (value not drawn)
D20  Led 5mm Rojo Difuso  [LED5mm ROJO]  (value not drawn)
D21#1  Led 5mm Rojo Difuso  [LED5mm ROJO]  (value not drawn)
D21#2  Led 5mm Rojo Difuso  [LED5mm ROJO]  (value not drawn)
D21#3  Led 5mm Rojo Difuso  [LED5mm ROJO]  (value not drawn)
D22  VOLTAJE: 6.3V  [D_SOD27]  (hidden comment: Zener)
D23  VOLTAJE: 4.3V  [D_SOD27]  (hidden comment: Zener)
HS1-7805  Thermal Resistance: 1°C/W  [HeatSink06]  (hidden comment: HEAT SINK)
M1  MODULE STEP DOWN 3A LM2596  [LM2596 MODULE]  (value not drawn)
Q3#1  IRF9530  [TO220]
Q3#2  IRF9530  [TO220]
Q4  BC817-40  [SOT23]
Q6  BC817-40  [SOT23]
Q7  BC817-40  [SOT23]
R50  value 1K  [R1206]  (hidden comment: Res)
R51  value 1K  [R1206]  (hidden comment: Res)
R52#1  value 1K  [R1206]  (hidden comment: Res)
R52#2  value 1K  [R1206]  (hidden comment: Res)
R52#3  value 1K  [R1206]  (hidden comment: Res)
R52#4  value 1K  [R1206]  (hidden comment: Res)
R53#1  value 1K  [R1206]  (hidden comment: Res)
R53#2  Resistencia: 1K  [R1206]  (hidden comment: Resistencia 1206; 1Kohm)
R54#1  Resistencia: 1K  [R1206]  (hidden comment: Resistencia 1206; 1Kohm)
R54#2  Resistencia: 1K  [res300th]  (hidden comment: Resistencia 1206; 1Kohm)
ROT?#7  Rotulo_empty  (value not drawn)  (graphical)
U11  LM7805  [TO220]
U13  78L33  [to92]

### Ports
AN_ENABLE (in)

### Nets
+3.3V: C19.1 R52#3.2 U13.1(OUT)
+5V: C18#1.1 C18#2.1 R51.2 U11.3(OUT) U13.3(IN)
+5V-DCDC: D23.2(K) M1.3(VO) Q3#1.3(S) R53#1.2 R54#1.1
+5V-OV-LIM: Q3#1.2(D) R52#1.2
+12V: C17.1 M1.1(VI) Q3#2.3(S) R50.2 R53#2.2 U11.1(IN)
GND: C17.2 C18#1.2 C18#2.2 C19.2 D19.2(K) D20.2(K) D21#1.2(K) D21#2.2(K) D22.1(A) M1.2(GND) M1.4(GND) Q4.2(E) Q6.2(E) Q7.2(E) U11.2(GND) U13.2(GND)
VDD: Q3#2.2(D) R52#4.2
AN_ENABLE: R54#2.1 ; port AN_ENABLE
NetD19_1: D19.1(A) R50.1
NetD20_1: D20.1(A) R51.1
NetD21#1_1: D21#1.1(A) R52#1.1
NetD21#2_1: D21#2.1(A) R52#3.1
NetD21#3_1: D21#3.1(A) R52#4.1
NetD21#3_2: D21#3.2(K) D22.2(K)
NetD23_1: D23.1(A) R52#2.2
NetQ3#1_1: Q3#1.1(G) Q6.3(C) R54#1.2
NetQ3#2_1: Q3#2.1(G) Q4.3(C) R53#2.1
NetQ4_1: Q4.1(B) R54#2.2
NetQ6_1: Q6.1(B) Q7.3(C) R53#1.1
NetQ7_1: Q7.1(B) R52#2.1

### Notes on the sheet
- (near M1) -- Estos 5V van al IDC q distribuye 5VDC a Galileo.
  -- Se eligió alimentar desde aqui a Galileo, porque Galileo no puede alimentar esta placa porque no le da la corriente. Al revés sí.
- An overvoltage protected 5V supply for Galileo.
- El unico que requiere 3.3V es la cámara.
- EVALUAR PONER 2 VOLTAJES DE TESTEO PARA PERMITIR DETECCION DE 1 O 2 LEDS EN CC
- MOSFET anode voltage (display positive power enable)
- -- En caso de querer usar segmentos con 3 paralelos, de los 12V se consumirán 1.92A@10mA/segmento.
- (near HS1-7805) HEATSINKS
- (near ROT?#7) intelGalileoIdcAdapter/powerSupply
- custom
- 2025-10-07
- (near ROT?#7) 1 of 1
- Federico Ramos
- (in symbol MODULE STEP DOWN 3A LM2596) STEP DOWN; MODULE; 3A LM2596
- (in symbol Rotulo_empty) Title:; Size:; Date:; Sheet:; Design:

### Library data of the parts
C17 C18#1 C18#2 C19 = Cap Pol: Capacitor Polarizado
D19 D20 D21#1-D21#3 = Led 5mm Rojo Difuso: Codigo Ebay: NA; Dolares Ebay: 0.06
D22 D23 = Zener: Zener Diode
Q3#1 Q3#2 = IRF9530: as Q2 on sheet pmosfet
Q4 Q6 Q7 = BC817-40: as Q1 on sheet pmosfet
R50 R51 R52#1-R52#4 R53#1 = Res: Resistencia; Power: 0.25W
R53#2 R54#1 R54#2 = Resistencia 1206; 1Kohm: as R47 on sheet pmosfet
ROT?#7 = Rotulo_empty: Rotulo [consolas]
U11 = LM78XX (v1): 3-Terminal Positive Regulator
U13 = 78L05; TO92: Dolares Elemon: 0.18050; Codigo Elemon: CI2707530

## Sheet extra.SchDoc: DE:TMP:11:UC:EXPANDIDO
size 233 x 191 mm; Date: 21-07-2022; SheetNumber: 1; SheetTotal: 1; WebFGR: www.abebashop.com; VersionFGR: 20220721; PageSetup: Record=PageOptions|CenterHorizontal=True|CenterVertical=True|PrintScale=0.94|XCorrection=1.00|YCorrection=1.00|PrintKind=0|BorderSize=5000000|LeftOffset=0|BottomOffset=0|Orientation=2|PaperLength=1000|PaperWidth=1000|Scale=100|PaperSource=7|PrintQuality=-4|MediaType=1|DitherType=10|PaperKind=Letter|PrintScaleMode=1
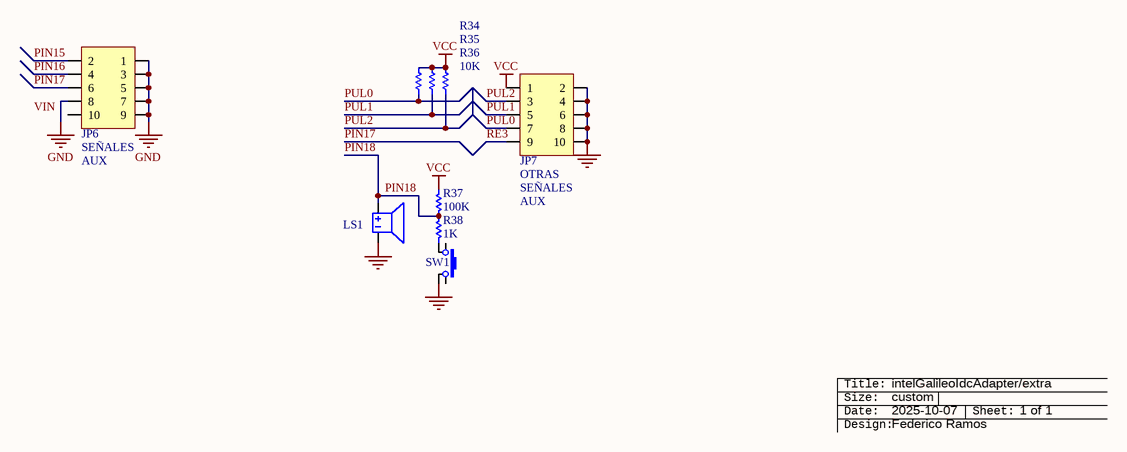
[diagram p8: extra.SchDoc]

### Parts
(Parts that share a designator on the sheet are numbered #1, #2 ... from top to bottom, then left to right.)
JP6  Price: SEÑALES  [idc5x2]  (hidden comment: IDC 5x2)
JP7  IDC 5x2  [idc5x2]  (value not drawn)
LS1  Buzzer  [buzzer12mm]  (value not drawn)
R34  Resistencia 1206; 10Kohm  [R1206]  (value not drawn)
R35  Resistencia 1206; 10Kohm  [R1206]  (value not drawn)
R36  Resistencia: 10K  [R1206]  (hidden comment: Resistencia 1206; 10Kohm)
R37  Resistencia: 100K  [R1206]  (hidden comment: Resistencia 1206; 10Kohm)
R38  Resistencia: 1K  [R1206]  (hidden comment: Resistencia 1206; 10Kohm)
ROT?#8  Rotulo_empty  (value not drawn)  (graphical)
SW1  SW_T_5MM  [SW_T_5MM]  (value not drawn)

### Nets
GND: JP6.1 JP6.3 JP6.5 JP6.7 JP6.8 JP6.9 JP7.2 JP7.4 JP7.6 JP7.8 JP7.10 LS1.2 SW1.2
VCC: JP7.1 R34.2 R35.2 R36.2 R37.2
PIN15: JP6.2
PIN16: JP6.4
PIN17: JP6.6
PIN18: LS1.1 R37.1 R38.2
PUL0: JP7.7 R34.1
PUL1: JP7.5 R35.1
PUL2: JP7.3 R36.1
RE3: JP7.9
NetR38_1: R38.1 SW1.1

Not connected (* = marked no-connect by the designer): JP6 10; SW1 3 4

### Notes on the sheet
- intelGalileoIdcAdapter/extra
- custom
- 2025-10-07
- (near ROT?#8) 1 of 1
- Federico Ramos
- Labels drawn without touching a wire or pin: VIN
- (in symbol IDC 5x2) AUX; OTRAS; SEÑALES
- (in symbol Rotulo_empty) Title:; Size:; Date:; Sheet:; Design:

### Library data of the parts
R34 R35 = Resistencia 1206; 10Kohm: Codigo Elemon: RS3886245; Dolares Elemon: 0.00718; Resistencia: 10K
R36-R38 = Resistencia 1206; 10Kohm: Codigo Elemon: RS3886245; Dolares Elemon: 0.00718
ROT?#8 = Rotulo_empty: Rotulo [consolas]

## Sheet camera.SchDoc
size 226 x 157 mm
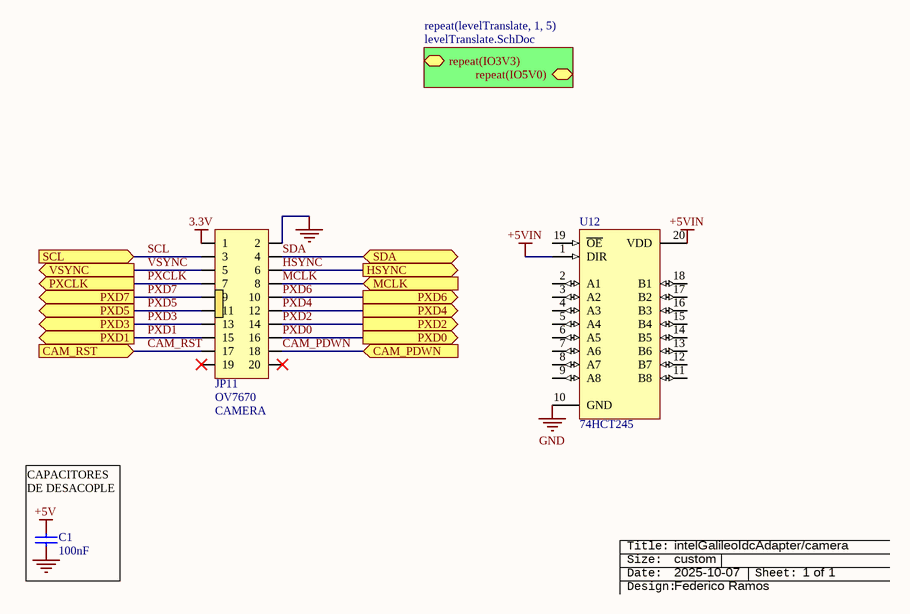
[diagram p9: camera.SchDoc]

### Parts
(Parts that share a designator on the sheet are numbered #1, #2 ... from top to bottom, then left to right.)
C1#2  value 100nF  [c1206]  (hidden comment: Cap)
JP11  MODULE: OV7670  NAME: CAMERA  [idc10x2]  (hidden comment: IDC 10x2)
ROT?#9  Rotulo_empty  (value not drawn)  (graphical)
U12  74HCT245  [DIP20Z]

### Sub-sheets
repeat(levelTranslate, 1, 5) = levelTranslate.SchDoc: repeat(IO3V3) (bidir), repeat(IO5V0) (bidir)

### Ports
CAM_PDWN (in), CAM_RST (in), HSYNC (out), MCLK (in), PXCLK (out), PXD0 (out), PXD1 (out), PXD2 (out), PXD3 (out), PXD4 (out), PXD5 (out), PXD6 (out), PXD7 (out), SCL (in), SDA (bidir), VSYNC (out)

### Nets
3.3V: JP11.1
+5V: C1#2.2
+5VIN: U12.1(DIR) U12.20(VDD)
GND: C1#2.1 JP11.2 U12.10(GND)
CAM_PDWN: JP11.18 ; port CAM_PDWN
CAM_RST: JP11.17 ; port CAM_RST
HSYNC: JP11.6 ; port HSYNC
MCLK: JP11.8 ; port MCLK
PXCLK: JP11.7 ; port PXCLK
PXD0: JP11.16 ; port PXD0
PXD1: JP11.15 ; port PXD1
PXD2: JP11.14 ; port PXD2
PXD3: JP11.13 ; port PXD3
PXD4: JP11.12 ; port PXD4
PXD5: JP11.11 ; port PXD5
PXD6: JP11.10 ; port PXD6
PXD7: JP11.9 ; port PXD7
SCL: JP11.3 ; port SCL
SDA: JP11.4 ; port SDA  [project net SCL]
VSYNC: JP11.5 ; port VSYNC

Not connected (* = marked no-connect by the designer): JP11 19* 20*; U12 2(A1) 3(A2) 4(A3) 5(A4) 6(A5) 7(A6) 8(A7) 9(A8) 11(B8) 12(B7) 13(B6) 14(B5) 15(B4) 16(B3) 17(B2) 18(B1) 19(~{OE})

### Notes on the sheet
- (near C1#2) CAPACITORES DE DESACOPLE
- intelGalileoIdcAdapter/camera
- custom
- 2025-10-07
- (near ROT?#9) 1 of 1
- Federico Ramos
- (in symbol Rotulo_empty) Title:; Size:; Date:; Sheet:; Design:

### Library data of the parts
C1#2 = Cap: Capacitor; Voltage: 50V
ROT?#9 = Rotulo_empty: Rotulo [consolas]
U12 = 74HCT245: Octal 3-State Non-Inverting Bus Transceiver with LSTTL-Compatible Inputs

## Sheet levelTranslate.SchDoc
size 127 x 76 mm
Used 5 times, as channels camera/levelTranslate1, camera/levelTranslate2, camera/levelTranslate3, camera/levelTranslate4, camera/levelTranslate5. Parts and nets are listed once, with the designators drawn on the sheet.
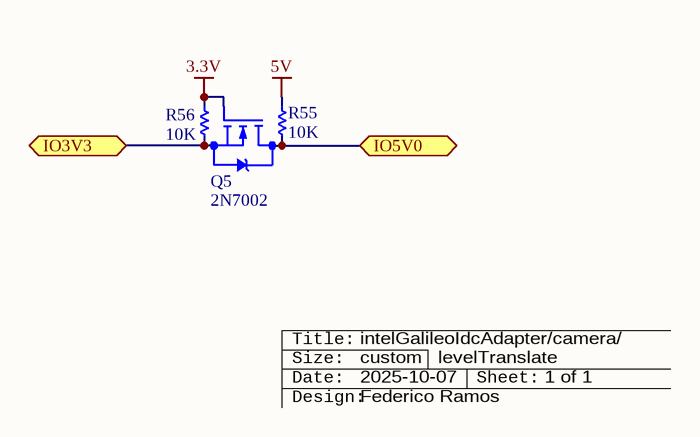
[diagram p10: levelTranslate.SchDoc]

### Parts
Q5  2N7002  [SOT23]
R55  value 10K  [R1206]  (hidden comment: Res)
R56  value 10K  [R1206]  (hidden comment: Res)
ROT?  Rotulo_empty_longTitle  (value not drawn)  (graphical)

### Ports
IO3V3 (bidir), IO5V0 (bidir)

### Nets
3.3V: Q5.1(G) R56.2
5V: R55.2
IO3V3: Q5.3(S) R56.1 ; port IO3V3
IO5V0: Q5.2(D) R55.1 ; port IO5V0

### Channels
camera/levelTranslate1: designators end in _levelTranslate1; ports IO3V3=NetQ5_levelTranslate1_3 IO5V0=NetQ5_levelTranslate1_2
camera/levelTranslate2: designators end in _levelTranslate2; ports IO3V3=NetQ5_levelTranslate2_3 IO5V0=NetQ5_levelTranslate2_2
camera/levelTranslate3: designators end in _levelTranslate3; ports IO3V3=NetQ5_levelTranslate3_3 IO5V0=NetQ5_levelTranslate3_2
camera/levelTranslate4: designators end in _levelTranslate4; ports IO3V3=NetQ5_levelTranslate4_3 IO5V0=NetQ5_levelTranslate4_2
camera/levelTranslate5: designators end in _levelTranslate5; ports IO3V3=NetQ5_levelTranslate5_3 IO5V0=NetQ5_levelTranslate5_2

### Notes on the sheet
- (near ROT?) intelGalileoIdcAdapter/camera/
- custom
- 2025-10-07
- levelTranslate
- (near ROT?) 1 of 1
- Federico Ramos
- (in symbol Rotulo_empty_longTitle) Title:; Size:; Date:; Sheet:; Design:

### Library data of the parts
Q5 = 2N7002: N-Channel MOSFET 60V  0.1A 7.5 ohm; pin to pad: 2>3 3>2
R55 R56 = Res: Resistencia; Power: 0.25W
ROT? = Rotulo_empty_longTitle: Rotulo [consolas]

## Sheet lcd.SchDoc: DE:TMP:11:UC:EXPANDIDO
size 208 x 137 mm; Date: 21-07-2022; SheetNumber: 1; SheetTotal: 1; WebFGR: www.abebashop.com; VersionFGR: 20220721; PageSetup: Record=PageOptions|CenterHorizontal=True|CenterVertical=True|PrintScale=0.94|XCorrection=1.00|YCorrection=1.00|PrintKind=0|BorderSize=5000000|LeftOffset=0|BottomOffset=0|Orientation=2|PaperLength=1000|PaperWidth=1000|Scale=100|PaperSource=7|PrintQuality=-4|MediaType=1|DitherType=10|PaperKind=Letter|PrintScaleMode=1
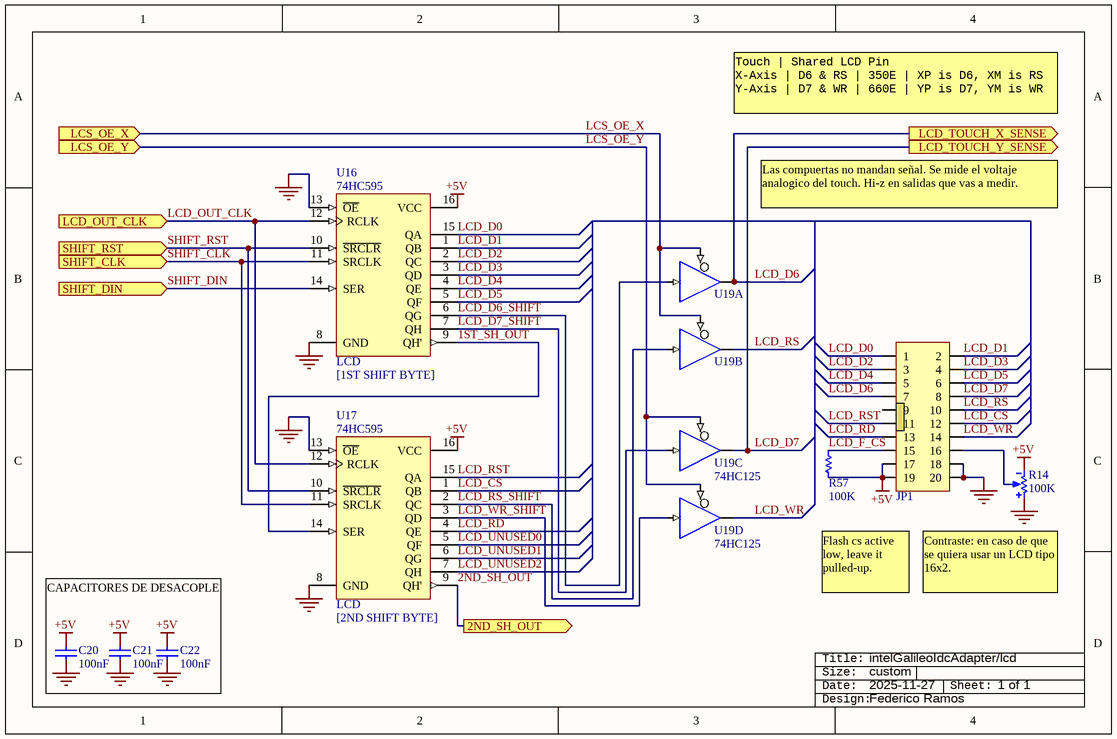
[diagram p11: lcd.SchDoc]

### Parts
(Parts that share a designator on the sheet are numbered #1, #2 ... from top to bottom, then left to right.)
C20  value 100nF  [c1206]  (hidden comment: Cap)
C21  value 100nF  [c1206]  (hidden comment: Cap)
C22  value 100nF  [c1206]  (hidden comment: Cap)
JP1  IDC 10x2  [idc10x2]  (value not drawn)
R14#2  value 100K  [PRESET6]  (hidden comment: Preset)
R57  Resistencia: 100K  [R1206]  (hidden comment: Resistencia 1206; 1Kohm)
ROT?#10  Rotulo_empty  (value not drawn)  (graphical)
U16  74HC595  [DIP16]
U17  74HC595  [DIP16]
U19  74HC125  [DIP14]  (value not drawn)  (parts A,B,C,D of 4)

### Ports
2ND_SH_OUT (out), LCD_OUT_CLK (in), LCD_TOUCH_X_SENSE (out), LCD_TOUCH_Y_SENSE (out), LCS_OE_X (in), LCS_OE_Y (in), SHIFT_CLK (in), SHIFT_DIN (in), SHIFT_RST (in)

### Nets
+5V: C20.2 C21.2 C22.2 JP1.17 JP1.19 R14#2.3 R57.1 U16.16(VCC) U17.16(VCC)
GND: C20.1 C21.1 C22.1 JP1.18 JP1.20 R14#2.1 U16.8(GND) U16.13(~{OE}) U17.8(GND) U17.13(~{OE}) U19.7(GND)
VCC: U19.14(VCC)
1ST_SH_OUT: U16.9(QH') U17.14(SER)
2ND_SH_OUT: U17.9(QH') ; port 2ND_SH_OUT
LCD_CS: JP1.12 U17.1(QB)
LCD_D0: JP1.1 U16.15(QA)
LCD_D1: JP1.2 U16.1(QB)
LCD_D2: JP1.3 U16.2(QC)
LCD_D3: JP1.4 U16.3(QD)
LCD_D4: JP1.5 U16.4(QE)
LCD_D5: JP1.6 U16.5(QF)
LCD_D6: JP1.7 U19.3(Y) ; port LCD_TOUCH_X_SENSE
LCD_D6_SHIFT: U16.6(QG) U19.2(B)
LCD_D7: JP1.8 U19.8(Y) ; port LCD_TOUCH_Y_SENSE
LCD_D7_SHIFT: U16.7(QH) U19.9(B)
LCD_F_CS: JP1.15 R57.2
LCD_OUT_CLK: U16.12(RCLK) U17.12(RCLK) ; port LCD_OUT_CLK
LCD_RD: JP1.13 U17.4(QE)
LCD_RS: JP1.10 U19.6(Y)
LCD_RS_SHIFT: U17.2(QC) U19.5(B)
LCD_RST: JP1.11 U17.15(QA)
LCD_UNUSED0: U17.5(QF)
LCD_UNUSED1: U17.6(QG)
LCD_UNUSED2: U17.7(QH)
LCD_WR: JP1.14 U19.11(Y)
LCD_WR_SHIFT: U17.3(QD) U19.12(B)
LCS_OE_X: U19.1(~{A}) U19.4(~{A}) ; port LCS_OE_X
LCS_OE_Y: U19.10(~{A}) U19.13(~{A}) ; port LCS_OE_Y
SHIFT_CLK: U16.11(SRCLK) U17.11(SRCLK) ; port SHIFT_CLK
SHIFT_DIN: U16.14(SER) ; port SHIFT_DIN
SHIFT_RST: U16.10(~{SRCLR}) U17.10(~{SRCLR}) ; port SHIFT_RST
NetJP1_16: JP1.16 R14#2.2

Not connected (* = marked no-connect by the designer): JP1 9

### Notes on the sheet
- Touch | Shared LCD Pin
  X-Axis | D6 & RS | 350E | XP is D6, XM is RS
  Y-Axis | D7 & WR | 660E | YP is D7, YM is WR
- Las compuertas no mandan señal. Se mide el voltaje analogico del touch. Hi-z en salidas que vas a medir.
- Flash cs active low, leave it pulled-up.
- Contraste: en caso de que se quiera usar un LCD tipo 16x2.
- CAPACITORES DE DESACOPLE
- intelGalileoIdcAdapter/lcd
- custom
- 2025-11-27
- (near ROT?#10) 1 of 1
- Federico Ramos
- (in symbol 74HC595) LCD; [2ND SHIFT BYTE]; [1ST SHIFT BYTE]
- (in symbol Rotulo_empty) Title:; Size:; Date:; Sheet:; Design:

### Library data of the parts
C20-C22 = Cap: Capacitor; Voltage: 50V
R14#2 = Preset: Resistencia Variable
R57 = Resistencia 1206; 1Kohm: as R47 on sheet pmosfet
ROT?#10 = Rotulo_empty: Rotulo [consolas]
U16 U17 = 74HC595: as U2 on sheet ldr
U19 = 74HC125: Quad 3-State Non-Inverting Buffer

## Sheet clkMapping.SchDoc: DE:TMP:11:UC:EXPANDIDO
size 137 x 76 mm; Date: 21-07-2022; SheetNumber: 1; SheetTotal: 1; WebFGR: www.abebashop.com; VersionFGR: 20220721; PageSetup: Record=PageOptions|CenterHorizontal=True|CenterVertical=True|PrintScale=0.94|XCorrection=1.00|YCorrection=1.00|PrintKind=0|BorderSize=5000000|LeftOffset=0|BottomOffset=0|Orientation=2|PaperLength=1000|PaperWidth=1000|Scale=100|PaperSource=7|PrintQuality=-4|MediaType=1|DitherType=10|PaperKind=Letter|PrintScaleMode=1
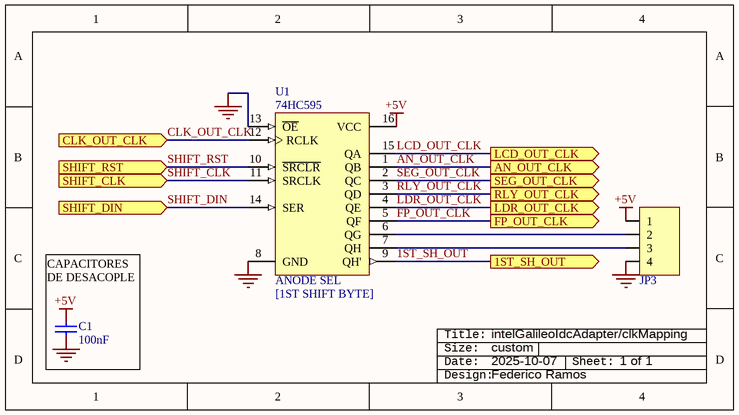
[diagram p12: clkMapping.SchDoc]

### Parts
(Parts that share a designator on the sheet are numbered #1, #2 ... from top to bottom, then left to right.)
C1#3  value 100nF  [c1206]  (hidden comment: Cap)
JP3  Header4x1  [HDR4x1]  (value not drawn)
ROT?#11  Rotulo_empty  (value not drawn)  (graphical)
U1#2  74HC595  [DIP16]

### Ports
1ST_SH_OUT (out), AN_OUT_CLK (out), CLK_OUT_CLK (in), FP_OUT_CLK (out), LCD_OUT_CLK (out), LDR_OUT_CLK (out), RLY_OUT_CLK (out), SEG_OUT_CLK (out), SHIFT_CLK (in), SHIFT_DIN (in), SHIFT_RST (in)

### Nets
+5V: C1#3.2 JP3.1 U1#2.16(VCC)
GND: C1#3.1 JP3.4 U1#2.8(GND) U1#2.13(~{OE})
1ST_SH_OUT: U1#2.9(QH') ; port 1ST_SH_OUT
AN_OUT_CLK: U1#2.1(QB) ; port AN_OUT_CLK
CLK_OUT_CLK: U1#2.12(RCLK) ; port CLK_OUT_CLK
FP_OUT_CLK: U1#2.5(QF) ; port FP_OUT_CLK
LCD_OUT_CLK: U1#2.15(QA) ; port LCD_OUT_CLK
LDR_OUT_CLK: U1#2.4(QE) ; port LDR_OUT_CLK
RLY_OUT_CLK: U1#2.3(QD) ; port RLY_OUT_CLK
SEG_OUT_CLK: U1#2.2(QC) ; port SEG_OUT_CLK
SHIFT_CLK: U1#2.11(SRCLK) ; port SHIFT_CLK
SHIFT_DIN: U1#2.14(SER) ; port SHIFT_DIN
SHIFT_RST: U1#2.10(~{SRCLR}) ; port SHIFT_RST
NetJP3_2: JP3.2 U1#2.6(QG)
NetJP3_3: JP3.3 U1#2.7(QH)

### Notes on the sheet
- (near C1#3) CAPACITORES DE DESACOPLE
- intelGalileoIdcAdapter/clkMapping
- custom
- 2025-10-07
- (near ROT?#11) 1 of 1
- Federico Ramos
- (in symbol 74HC595) ANODE SEL; [1ST SHIFT BYTE]
- (in symbol Rotulo_empty) Title:; Size:; Date:; Sheet:; Design:

### Library data of the parts
C1#3 = Cap: Capacitor; Voltage: 50V; Price: 0.25; Technology: Ceramic
JP3 = Header4x1: Header 4x1; Price: ?
ROT?#11 = Rotulo_empty: Rotulo [consolas]
U1#2 = 74HC595: as U2 on sheet ldr

## Sheet signalTable.SchDoc
size 127 x 127 mm
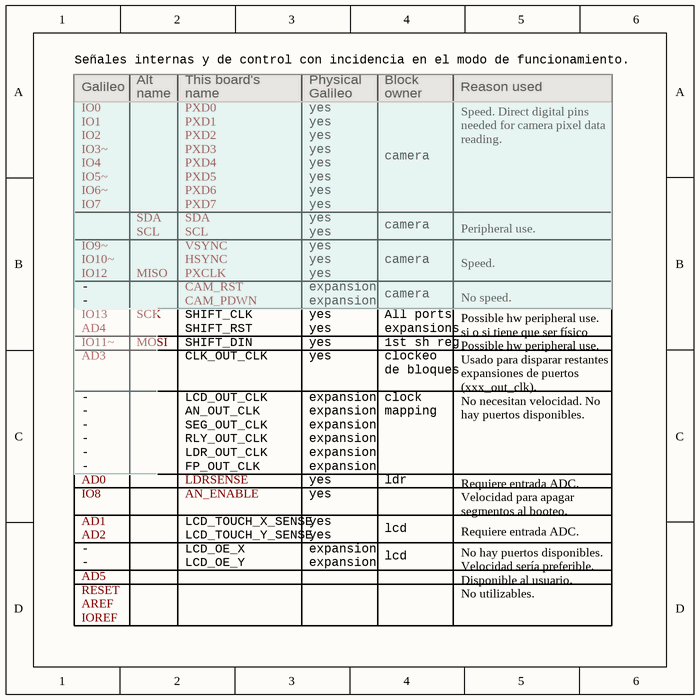
[diagram p13: signalTable.SchDoc]

### Notes on the sheet
- Señales internas y de control con incidencia en el modo de funcionamiento.
- Galileo
- Alt
- name
- This board's
- Physical
- Block
- owner
- Reason used
- yes
- camera
- Speed. Direct digital pins needed for camera pixel data reading.
- Peripheral use.
- -
- expansion
- Speed.
- No speed.
- SHIFT_DIN
- SHIFT_CLK
- SHIFT_RST
- CLK_OUT_CLK
- All ports
- expansions
- de bloques
- clockeo
- 1st sh reg
- Possible hw peripheral use.
- si o si tiene que ser físico
- LCD_OUT_CLK
- AN_OUT_CLK
- SEG_OUT_CLK
- RLY_OUT_CLK
- clock
- mapping
- Usado para disparar restantes expansiones de puertos (xxx_out_clk).
- No necesitan velocidad. No hay puertos disponibles.
- LDR_OUT_CLK
- FP_OUT_CLK
- ldr
- Requiere entrada ADC.
- Velocidad para apagar segmentos al booteo.
- LCD_TOUCH_X_SENSE
- LCD_TOUCH_Y_SENSE
- LCD_OE_X
- LCD_OE_Y
- lcd
- No hay puertos disponibles. Velocidad sería preferible.
- Disponible al usuario.
- No utilizables.
- Labels drawn without touching a wire or pin: AD0, AD1, AD2, AD3, AD4, AD5, AN_ENABLE, AREF, CAM_PDWN, CAM_RST, HSYNC, IO0, IO1, IO2, IO3~, IO4, IO5~, IO6~, IO7, IO8, IO9~, IO10~, IO11~, IO12, IO13, IOREF, LDRSENSE, MISO, MOSI, PXCLK, PXD0, PXD1, PXD2, PXD3, PXD4, PXD5, PXD6, PXD7, RESET, SCK, SCL, SDA, VSYNC

## Nets that join several sheets
3.3V: camera (JP11.1), camera/levelTranslate1 (Q5_levelTranslate1.1 R56_levelTranslate1.2), camera/levelTranslate2 (Q5_levelTranslate2.1 R56_levelTranslate2.2), camera/levelTranslate3 (Q5_levelTranslate3.1 R56_levelTranslate3.2), camera/levelTranslate4 (Q5_levelTranslate4.1 R56_levelTranslate4.2), camera/levelTranslate5 (Q5_levelTranslate5.1 R56_levelTranslate5.2)
5V: camera/levelTranslate1 (R55_levelTranslate1.2), camera/levelTranslate2 (R55_levelTranslate2.2), camera/levelTranslate3 (R55_levelTranslate3.2), camera/levelTranslate4 (R55_levelTranslate4.2), camera/levelTranslate5 (R55_levelTranslate5.2)
+5V: disp7segTester (C4.1 JP4.18 JP4.20), ldr (7 pins), segments (C14.2 U7.8 U8.16), relayNetwork (C8.1 C11.2 U5.16), anodes (C1#1.2 U1#1.16), freePort (C16.2 U10.16), powerSupply (5 pins), camera (C1#2.2), lcd (9 pins), clkMapping (C1#3.2 JP3.1 U1#2.16)
+12V: disp7segTester (C2.1 C3.1 JP4.17 JP4.19), ldr (C5.1 C7.2), segments (C13.1 C15.2 U9.10), relayNetwork (14 pins), powerSupply (6 pins)
GND: disp7segTester (15 pins), ldr (8 pins), segments (10 pins), relayNetwork (8 pins), anodes (C1#1.1 U1#1.8 U1#1.13), pmosfet1 (Q1_pmosfet1.2), pmosfet2 (Q1_pmosfet2.2), pmosfet3 (Q1_pmosfet3.2), pmosfet4 (Q1_pmosfet4.2), pmosfet5 (Q1_pmosfet5.2), pmosfet6 (Q1_pmosfet6.2), pmosfet7 (Q1_pmosfet7.2), pmosfet8 (Q1_pmosfet8.2), freePort (11 pins), powerSupply (16 pins), extra (13 pins), camera (C1#2.1 JP11.2 U12.10), lcd (11 pins), clkMapping (C1#3.1 JP3.4 U1#2.8 U1#2.13)
VCC: ldr (U4.5 U4.6 U4.8), segments (U7.5 U7.6 U7.8), extra (5 pins), lcd (U19.14)
VDD: pmosfet1 (Q2_pmosfet1.3 R47_pmosfet1.2), pmosfet2 (Q2_pmosfet2.3 R47_pmosfet2.2), pmosfet3 (Q2_pmosfet3.3 R47_pmosfet3.2), pmosfet4 (Q2_pmosfet4.3 R47_pmosfet4.2), pmosfet5 (Q2_pmosfet5.3 R47_pmosfet5.2), pmosfet6 (Q2_pmosfet6.3 R47_pmosfet6.2), pmosfet7 (Q2_pmosfet7.3 R47_pmosfet7.2), pmosfet8 (Q2_pmosfet8.3 R47_pmosfet8.2), powerSupply (Q3#2.2 R52#4.2)
4TH_SH_OUT: segments (U8.9), relayNetwork (U5.14)
5TH_SH_OUT: ldr (U2.14), relayNetwork (U5.9)
6TH_SH_OUT: ldr (U2.9), freePort (U10.14)
A: disp7segTester (JP2.13), segments (R26.1)
ADRV: anodes (U1#1.15), pmosfet1 (R49_pmosfet1.1)
ADRV: anodes (U1#1.1), pmosfet2 (R49_pmosfet2.1)
ADRV: anodes (U1#1.2), pmosfet3 (R49_pmosfet3.1)
ADRV: anodes (U1#1.3), pmosfet4 (R49_pmosfet4.1)
ADRV: anodes (U1#1.4), pmosfet5 (R49_pmosfet5.1)
ADRV: anodes (U1#1.5), pmosfet6 (R49_pmosfet6.1)
ADRV: anodes (U1#1.6), pmosfet7 (R49_pmosfet7.1)
ADRV: anodes (U1#1.7), pmosfet8 (R49_pmosfet8.1)
B: disp7segTester (JP2.15), segments (R27.1), relayNetwork (K1.3)
C: disp7segTester (JP2.7), segments (R33.1), relayNetwork (K5.3)
D: disp7segTester (JP2.3), segments (R32.1), relayNetwork (K4.8)
DP: disp7segTester (JP2.1), segments (R31.1)
E: disp7segTester (JP2.5), segments (R30.1), relayNetwork (K3.3)
F: disp7segTester (JP2.11), segments (R28.1)
FP1: disp7segTester (JP4.16), freePort (R39.2 U10.15)
FP2: disp7segTester (JP4.14), freePort (R40.2 U10.1)
FP3: disp7segTester (JP4.12), freePort (R41.2 U10.2)
FP4: disp7segTester (JP4.10), freePort (R42.2 U10.3)
FP5: disp7segTester (JP4.8), freePort (R43.2 U10.4)
FP6: disp7segTester (JP4.6), freePort (R44.2 U10.5)
FP7: disp7segTester (JP4.4), freePort (R45.2 U10.6)
FP8: disp7segTester (JP4.2), freePort (R46.2 U10.7)
G: disp7segTester (JP2.9), segments (R29.1), relayNetwork (K2.8)
NetD9_2: segments (D9.2 R22.2), relayNetwork (6 pins)
NetK1_8: segments (R26.2 U9.18), relayNetwork (K1.8)
NetK2_3: segments (R27.2 U9.17), relayNetwork (K2.3)
NetK3_8: segments (R29.2 U9.15), relayNetwork (K3.8)
NetK4_3: segments (R30.2 U9.14), relayNetwork (K4.3)
NetK5_8: segments (R32.2 U9.12), relayNetwork (K5.8)
SCL: disp7segTester (JP8.3), camera (JP11.3)
SCL: disp7segTester (JP8.4), camera (JP11.4)
SHIFT_CLK: segments (U8.11), relayNetwork (U5.11), anodes (U1#1.11), freePort (U10.11), lcd (U16.11 U17.11)
SHIFT_RST: segments (U8.10), relayNetwork (U5.10), anodes (U1#1.10), freePort (U10.10), lcd (U16.10 U17.10)